# EAGLE schematic YAZ180_V22 (EAGLE 6.6.0)

## Sheet 1 of 7
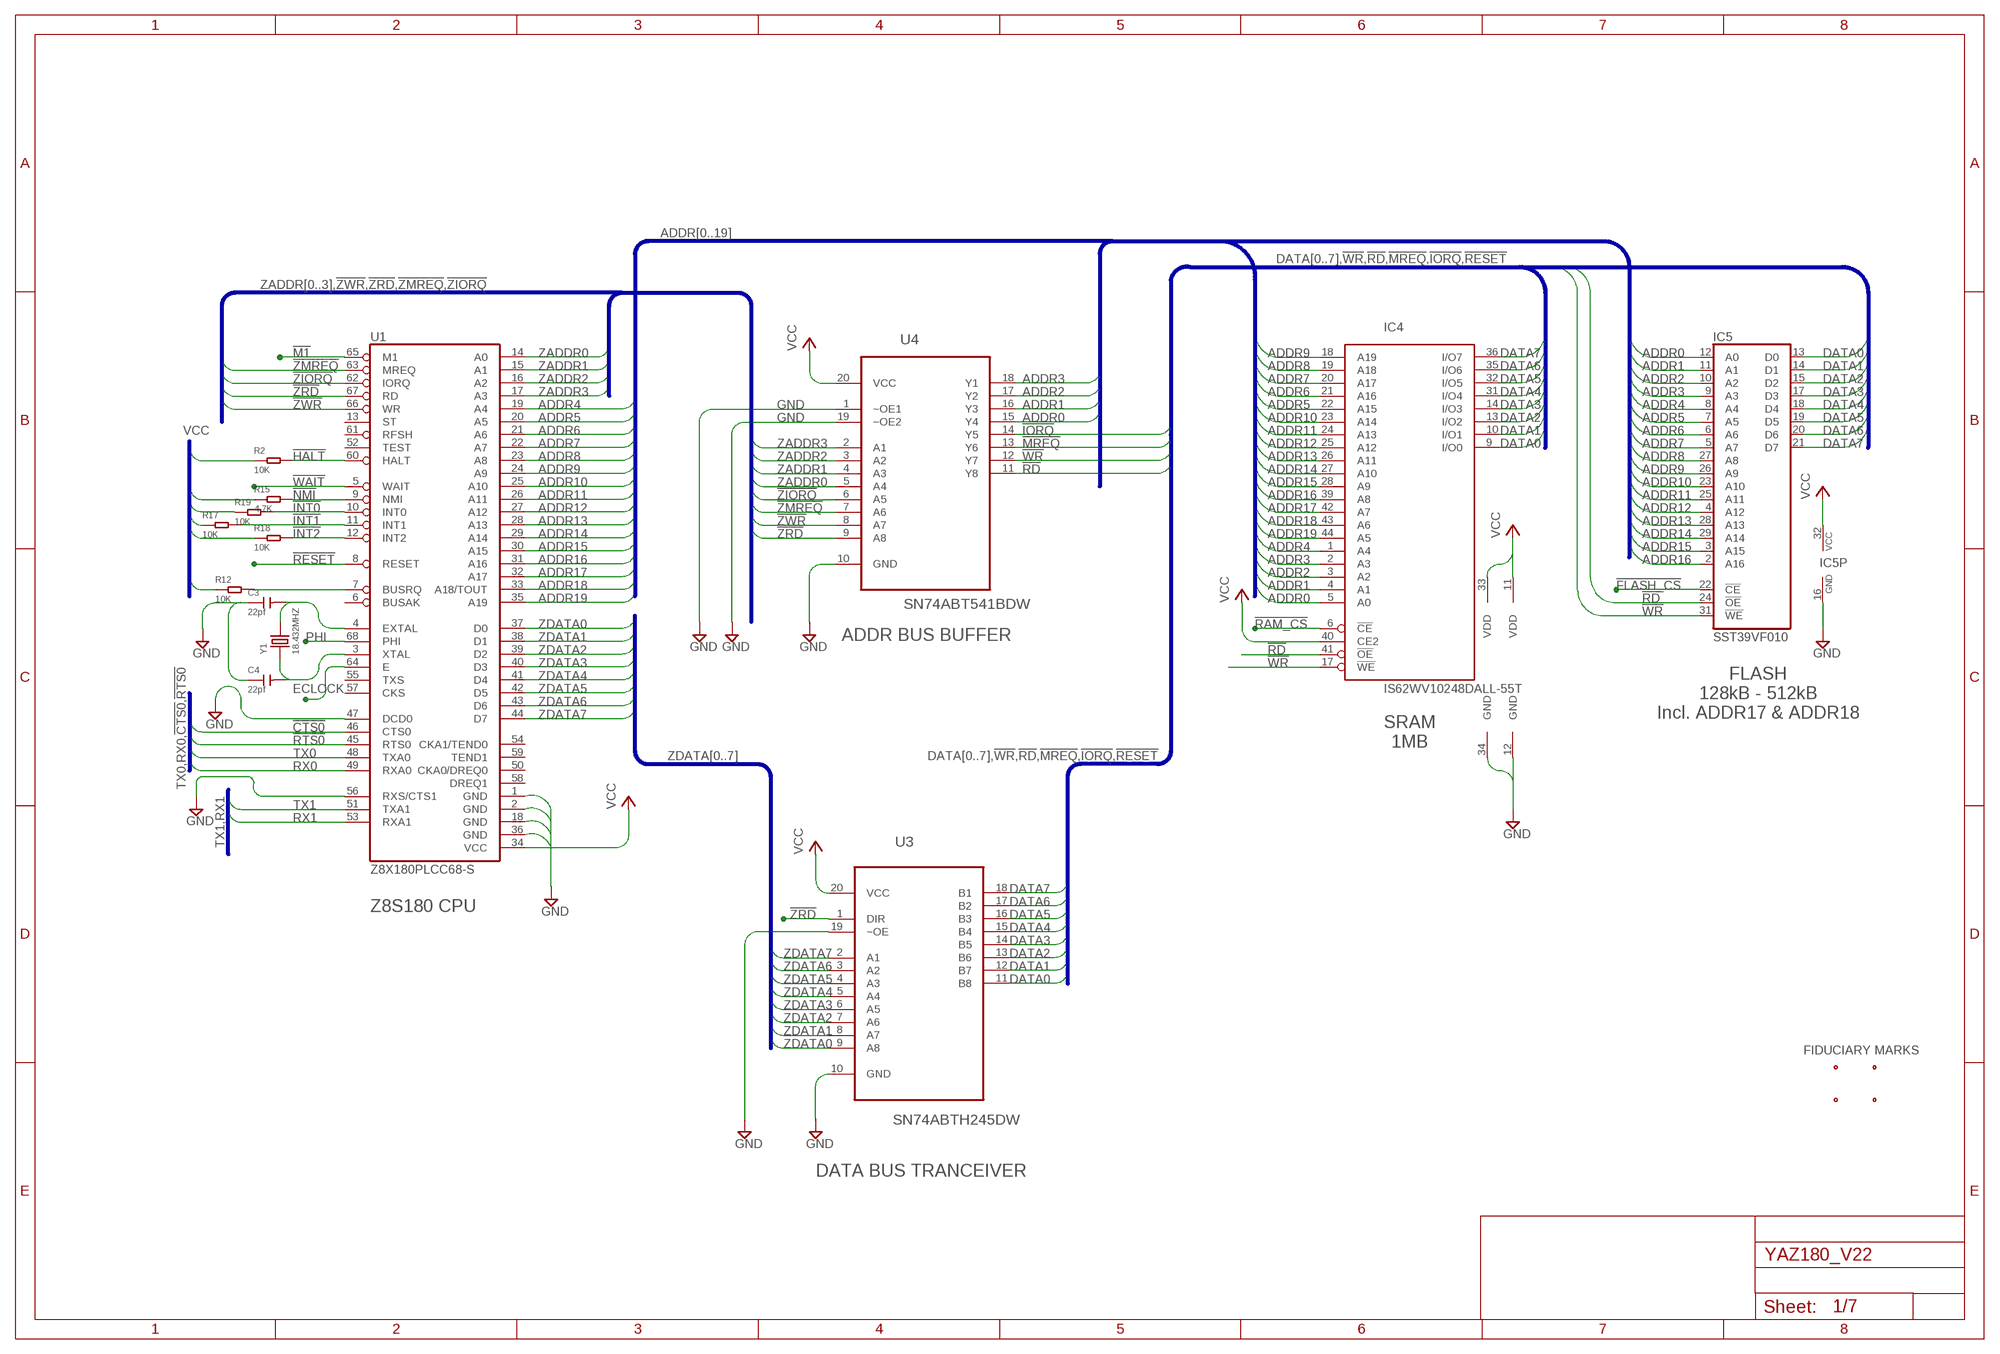
[diagram p0: schematic, sheet 1]

### Parts
C3  22pf  CERAMIC-22PF-50V-5%-NPO(0603)  [C0603]
C4  22pf  CERAMIC-22PF-50V-5%-NPO(0603)  [C0603]
IC4  IS62WV10248DALL-55T  [TSOP-II-44]
IC5  SST39VF010  [S32]
R2  10K  SMD-RES-10K-1%-1/10W(0603)  [R0603]
R12  10K  SMD-RES-10K-1%-1/10W(0603)  [R0603]
R15  4.7K  SMD-RES-4.7K-5%-1/10W(0603)  [R0603]
R17  10K  SMD-RES-10K-1%-1/10W(0603)  [R0603]
R18  10K  SMD-RES-10K-1%-1/10W(0603)  [R0603]
R19  10K  SMD-RES-10K-1%-1/10W(0603)  [R0603]
U1  Z8X180PLCC68-S  [PLCC-S68]
U3  SN74ABTH245DW  [SOIC127P1030X265-20N]
U4  SN74ABT541BDW  [SOIC127P1030X265-20N]
X3  FIDUCIAL_0.6-1.2MM  [FIDUCIAL0.6-1.2]
X4  FIDUCIAL_0.6-1.2MM  [FIDUCIAL0.6-1.2]
X5  FIDUCIAL_0.6-1.2MM  [FIDUCIAL0.6-1.2]
X6  FIDUCIAL_0.6-1.2MM  [FIDUCIAL0.6-1.2]
Y1  18.432MHZ  DIP-CRYSTAL-25MHZ-20PF-20PPM(HC49US)  [HC49US]

### Nets
!BUSRQ: R12.2 U1.7(BUSRQ)
!CTS0: U1.46(CTS0) ; also sheet 4
!FLASH_CS: IC5.22(!CE) ; also sheet 2
!HALT: R2.2 U1.60(HALT) ; also sheet 2
!INT0: R19.2 U1.10(INT0) ; also sheet 5
!INT1: R17.2 U1.11(INT1) ; also sheet 5
!INT2: R18.2 U1.12(INT2) ; also sheet 5
!IORQ: U4.14(Y5) ; also sheet 2
!M1: U1.65(M1) ; also sheet 2
!MREQ: U4.13(Y6) ; also sheet 2
!NMI: R15.2 U1.9(NMI)
!RAM_CS: IC4.6(!CE) ; also sheet 2
!RD: IC4.41(!OE) IC5.24(!OE) U4.11(Y8) ; also sheet 2,3,5,6
!RESET: U1.8(RESET) ; also sheet 2,5
!RTS0: U1.45(RTS0) ; also sheet 4
!WAIT: U1.5(WAIT) ; also sheet 2,3
!WR: IC4.17(!WE) IC5.31(!WE) U4.12(Y7) ; also sheet 2,5,6
!ZIORQ: U1.62(IORQ) U4.6(A5)
!ZMREQ: U1.63(MREQ) U4.7(A6)
!ZRD: U1.67(RD) U3.1(DIR) U4.9(A8)
!ZWR: U1.66(WR) U4.8(A7) ; also sheet 5
ADDR0: IC4.5(A0) IC5.12(A0) U4.15(Y4) ; also sheet 3,5,6
ADDR1: IC4.4(A1) IC5.11(A1) U4.16(Y3) ; also sheet 3,5,6
ADDR2: IC4.3(A2) IC5.10(A2) U4.17(Y2) ; also sheet 3
ADDR3: IC4.2(A3) IC5.9(A3) U4.18(Y1) ; also sheet 3
ADDR4: IC4.1(A4) IC5.8(A4) U1.19(A4) ; also sheet 3
ADDR5: IC4.22(A15) IC5.7(A5) U1.20(A5) ; also sheet 3
ADDR6: IC4.21(A16) IC5.6(A6) U1.21(A6) ; also sheet 3
ADDR7: IC4.20(A17) IC5.5(A7) U1.22(A7) ; also sheet 3
ADDR8: IC4.19(A18) IC5.27(A8) U1.23(A8) ; also sheet 3
ADDR9: IC4.18(A19) IC5.26(A9) U1.24(A9) ; also sheet 3
ADDR10: IC4.23(A14) IC5.23(A10) U1.25(A10) ; also sheet 3
ADDR11: IC4.24(A13) IC5.25(A11) U1.26(A11) ; also sheet 3
ADDR12: IC4.25(A12) IC5.4(A12) U1.27(A12) ; also sheet 3
ADDR13: IC4.26(A11) IC5.28(A13) U1.28(A13) ; also sheet 2,3
ADDR14: IC4.27(A10) IC5.29(A14) U1.29(A14) ; also sheet 2,3
ADDR15: IC4.28(A9) IC5.3(A15) U1.30(A15) ; also sheet 2,3
ADDR16: IC4.39(A8) IC5.2(A16) U1.31(A16) ; also sheet 2,3
ADDR17: IC4.42(A7) U1.32(A17) ; also sheet 2,3,5
ADDR18: IC4.43(A6) U1.33(A18/TOUT) ; also sheet 2,3,5
ADDR19: IC4.44(A5) U1.35(A19) ; also sheet 2,3,5
DATA0: IC4.9(I/O0) IC5.13(D0) U3.11(B8) ; also sheet 3,4,5,6
DATA1: IC4.10(I/O1) IC5.14(D1) U3.12(B7) ; also sheet 3,4,5,6
DATA2: IC4.13(I/O2) IC5.15(D2) U3.13(B6) ; also sheet 3,4,5,6
DATA3: IC4.14(I/O3) IC5.17(D3) U3.14(B5) ; also sheet 3,4,5,6
DATA4: IC4.31(I/O4) IC5.18(D4) U3.15(B4) ; also sheet 3,4,5,6
DATA5: IC4.32(I/O5) IC5.19(D5) U3.16(B3) ; also sheet 3,4,5,6
DATA6: IC4.35(I/O6) IC5.20(D6) U3.17(B2) ; also sheet 3,4,5,6
DATA7: IC4.36(I/O7) IC5.21(D7) U3.18(B1) ; also sheet 3,4,5,6
ECLOCK: U1.64(E) ; also sheet 5
EXTAL: C3.2 U1.4(EXTAL) Y1.2
GND [POWER]: C3.1 C4.1 IC4.12(GND) IC4.34(GND) IC5.16(GND) U1.1(GND) U1.2(GND) U1.18(GND) U1.36(GND) U1.47(DCD0) U1.56(RXS/CTS1) U3.10(GND) U3.19(~OE) U4.1(~OE1) U4.10(GND) U4.19(~OE2) ; also sheet 2,3,4,5,6,7
PHI: U1.68(PHI) ; also sheet 5
RX0: U1.49(RXA0) ; also sheet 4
RX1: U1.53(RXA1) ; also sheet 4
TX0: U1.48(TXA0) ; also sheet 4
TX1: U1.51(TXA1) ; also sheet 4
VCC [POWER]: IC4.11(VDD) IC4.33(VDD) IC4.40(CE2) IC5.32(VCC) R2.1 R12.1 R15.1 R17.1 R18.1 R19.1 U1.34(VCC) U3.20(VCC) U4.20(VCC) ; also sheet 2,3,4,5,6,7
XTAL: C4.2 U1.3(XTAL) Y1.1
ZADDR0: U1.14(A0) U4.5(A4)
ZADDR1: U1.15(A1) U4.4(A3)
ZADDR2: U1.16(A2) U4.3(A2)
ZADDR3: U1.17(A3) U4.2(A1)
ZDATA0: U1.37(D0) U3.9(A8)
ZDATA1: U1.38(D1) U3.8(A7)
ZDATA2: U1.39(D2) U3.7(A6)
ZDATA3: U1.40(D3) U3.6(A5)
ZDATA4: U1.41(D4) U3.5(A4)
ZDATA5: U1.42(D5) U3.4(A3)
ZDATA6: U1.43(D6) U3.3(A2)
ZDATA7: U1.44(D7) U3.2(A1)
Unconnected: U1.6(BUSAK) U1.13(ST) U1.50(CKA0/DREQ0) U1.52(TEST) U1.54(CKA1/TEND0) U1.55(TXS) U1.57(CKS) U1.58(DREQ1) U1.59(TEND1) U1.61(RFSH)

### Buses
ADDR[0..19]
DATA[0..7],!WR,!RD,!MREQ,!IORQ,!RESET
TX0,RX0,!CTS0,!RTS0
TX1,RX1
VCC
ZADDR[0..3],!ZWR,!ZRD,!ZMREQ,!ZIORQ
ZDATA[0..7]

### Notes on the sheet
- ADDR BUS BUFFER
- FLASH
  128kB - 512kB
  Incl. ADDR17 & ADDR18
- SRAM
  1MB
- Z8S180 CPU
- FIDUCIARY MARKS
- DATA BUS TRANCEIVER

## Sheet 2 of 7
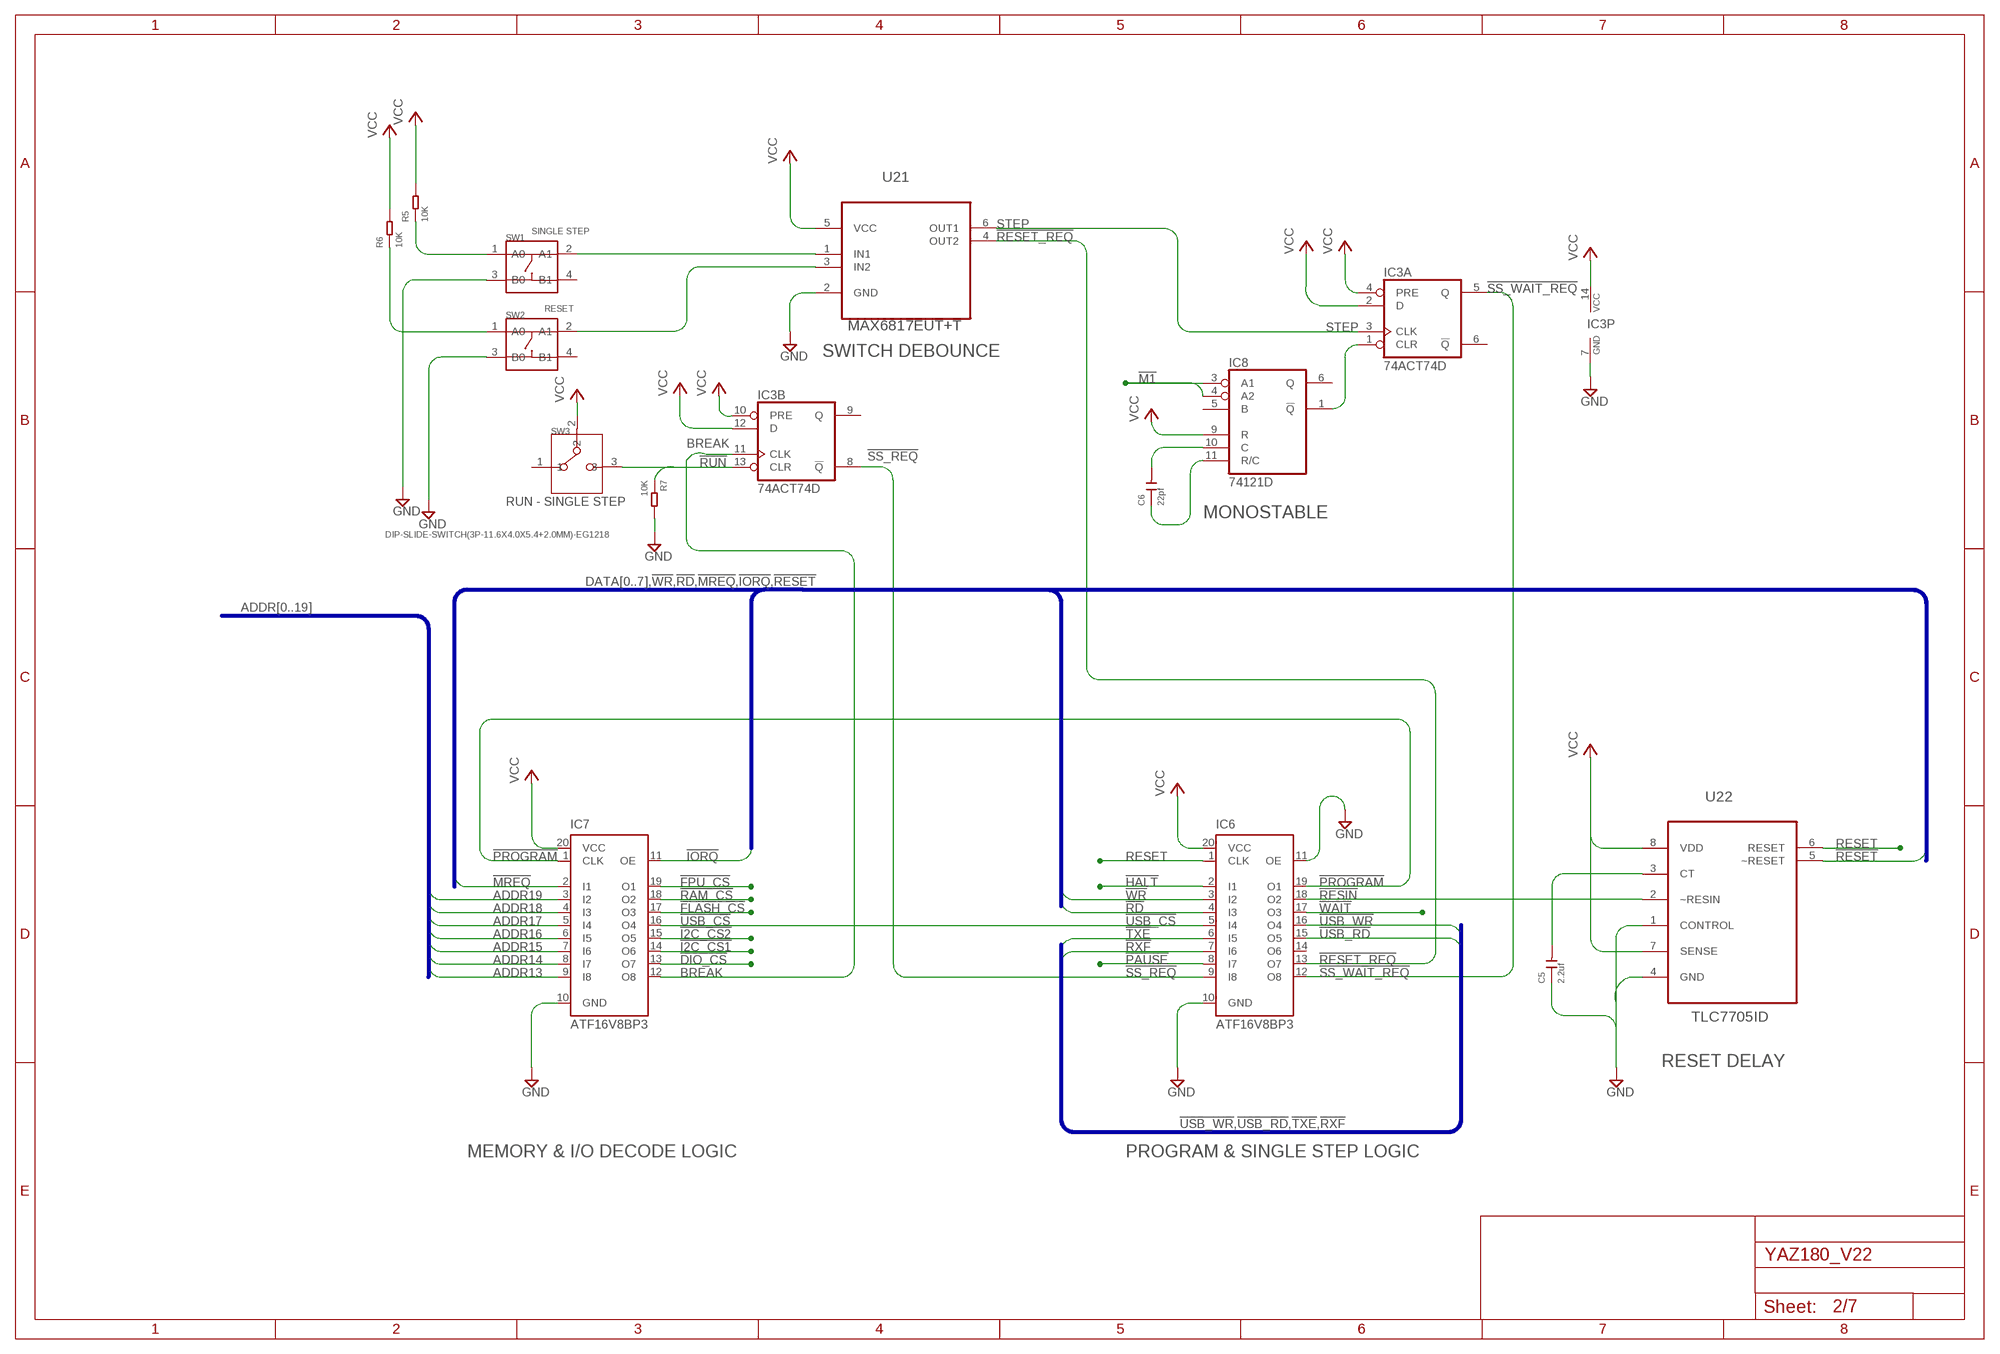
[diagram p1: schematic, sheet 2]

### Parts
C5  2.2uf  CERAMIC-2.2UF-10V-10%-X7R(0603)  [C0603]
C6  22pf  CERAMIC-22PF-50V-5%-NPO(0603)  [C0603]
IC3  74ACT74D  [SO14]
IC6  ATF16V8BP3  [DIL20]
IC7  ATF16V8BP3  [DIL20]
IC8  74121D  [SO14]
R5  10K  SMD-RES-10K-1%-1/10W(0603)  [R0603]
R6  10K  SMD-RES-10K-1%-1/10W(0603)  [R0603]
R7  10K  SMD-RES-10K-1%-1/10W(0603)  [R0603]
SW1  SINGLE STEP  SMD-BUTTON(4P-4.0X4.0X1.7MM)-DHT-1152  [SW4-SMD-4.0X4.0X1.7MM]
SW2  RESET  SMD-BUTTON(4P-4.0X4.0X1.7MM)-DHT-1152  [SW4-SMD-4.0X4.0X1.7MM]
SW3  DIP-SLIDE-SWITCH(3P-11.6X4.0X5.4+2.0MM)-EG1218  [SW3-2.5-11.6X4.0X5.4+2.0MM]
U21  MAX6817EUT+T  [SOT95P280X145-6N]
U22  TLC7705ID  [SOIC127P600X175-8N]

### Nets
!DIO_CS: IC7.13(O7) ; also sheet 6
!FLASH_CS: IC7.17(O3) ; also sheet 1
!FPU_CS: IC7.19(O1) ; also sheet 5
!HALT: IC6.2(I1) ; also sheet 1
!I2C_CS1: IC7.14(O6) ; also sheet 5
!I2C_CS2: IC7.15(O5) ; also sheet 5
!IORQ: IC7.11(OE) ; also sheet 1
!M1: IC8.3(A1) IC8.4(A2) ; also sheet 1
!MREQ: IC7.2(I1) ; also sheet 1
!PAUSE: IC6.8(I7) ; also sheet 5
!PROGRAM: IC6.19(O1) IC7.1(CLK)
!RAM_CS: IC7.18(O2) ; also sheet 1
!RD: IC6.4(I3) ; also sheet 1,3,5,6
!RESET: U22.5(~RESET) ; also sheet 1,5
!RESET_REQ: IC6.13(O7) U21.4(OUT2)
!RESIN: IC6.18(O2) U22.2(~RESIN)
!RUN: IC3.13(B:CLR) R7.1 SW3.3
!RXF: IC6.7(I6) ; also sheet 4
!SS_REQ: IC3.8(B:!Q) IC6.9(I8)
!SS_WAIT_REQ: IC3.5(A:Q) IC6.12(O8)
!TXE: IC6.6(I5) ; also sheet 4
!USB_CS: IC6.5(I4) IC7.16(O4)
!USB_RD: IC6.15(O5) ; also sheet 4
!USB_WR: IC6.16(O4) ; also sheet 4
!WAIT: IC6.17(O3) ; also sheet 1,3
!WR: IC6.3(I2) ; also sheet 1,5,6
ADDR13: IC7.9(I8) ; also sheet 1,3
ADDR14: IC7.8(I7) ; also sheet 1,3
ADDR15: IC7.7(I6) ; also sheet 1,3
ADDR16: IC7.6(I5) ; also sheet 1,3
ADDR17: IC7.5(I4) ; also sheet 1,3,5
ADDR18: IC7.4(I3) ; also sheet 1,3,5
ADDR19: IC7.3(I2) ; also sheet 1,3,5
BREAK: IC3.11(B:CLK) IC7.12(O8)
GND [POWER]: C5.1 IC3.7(P:GND) IC6.10(GND) IC6.11(OE) IC7.10(GND) R7.2 SW1.3(B0) SW2.3(B0) U21.2(GND) U22.1(CONTROL) U22.4(GND) ; also sheet 1,3,4,5,6,7
N$1: IC3.1(A:CLR) IC8.1(!Q)
N$66: C5.2 U22.3(CT)
N$69: C6.2 IC8.10(C)
N$71: SW1.2(A1) U21.1(IN1)
N$74: R5.1 SW1.1(A0)
N$75: R6.1 SW2.1(A0)
N$76: SW2.2(A1) U21.3(IN2)
N$77: C6.1 IC8.11(R/C)
RESET: IC6.1(CLK) U22.6(RESET) ; also sheet 5,6
STEP: IC3.3(A:CLK) U21.6(OUT1)
VCC [POWER]: IC3.2(A:D) IC3.4(A:PRE) IC3.10(B:PRE) IC3.12(B:D) IC3.14(P:VCC) IC6.20(VCC) IC7.20(VCC) IC8.9(R) R5.2 R6.2 SW3.2 U21.5(VCC) U22.7(SENSE) U22.8(VDD) ; also sheet 1,3,4,5,6,7
Unconnected: IC3.6(A:!Q) IC3.9(B:Q) IC6.14(O6) IC8.5(B) IC8.6(Q) SW1.4(B1) SW2.4(B1) SW3.1

### Buses
ADDR[0..19]
DATA[0..7],!WR,!RD,!MREQ,!IORQ,!RESET
!USB_WR,!USB_RD,!TXE,!RXF

### Notes on the sheet
- SWITCH DEBOUNCE
- RUN - SINGLE STEP
- MONOSTABLE
- RESET DELAY
- MEMORY & I/O DECODE LOGIC | PROGRAM & SINGLE STEP LOGIC

## Sheet 3 of 7
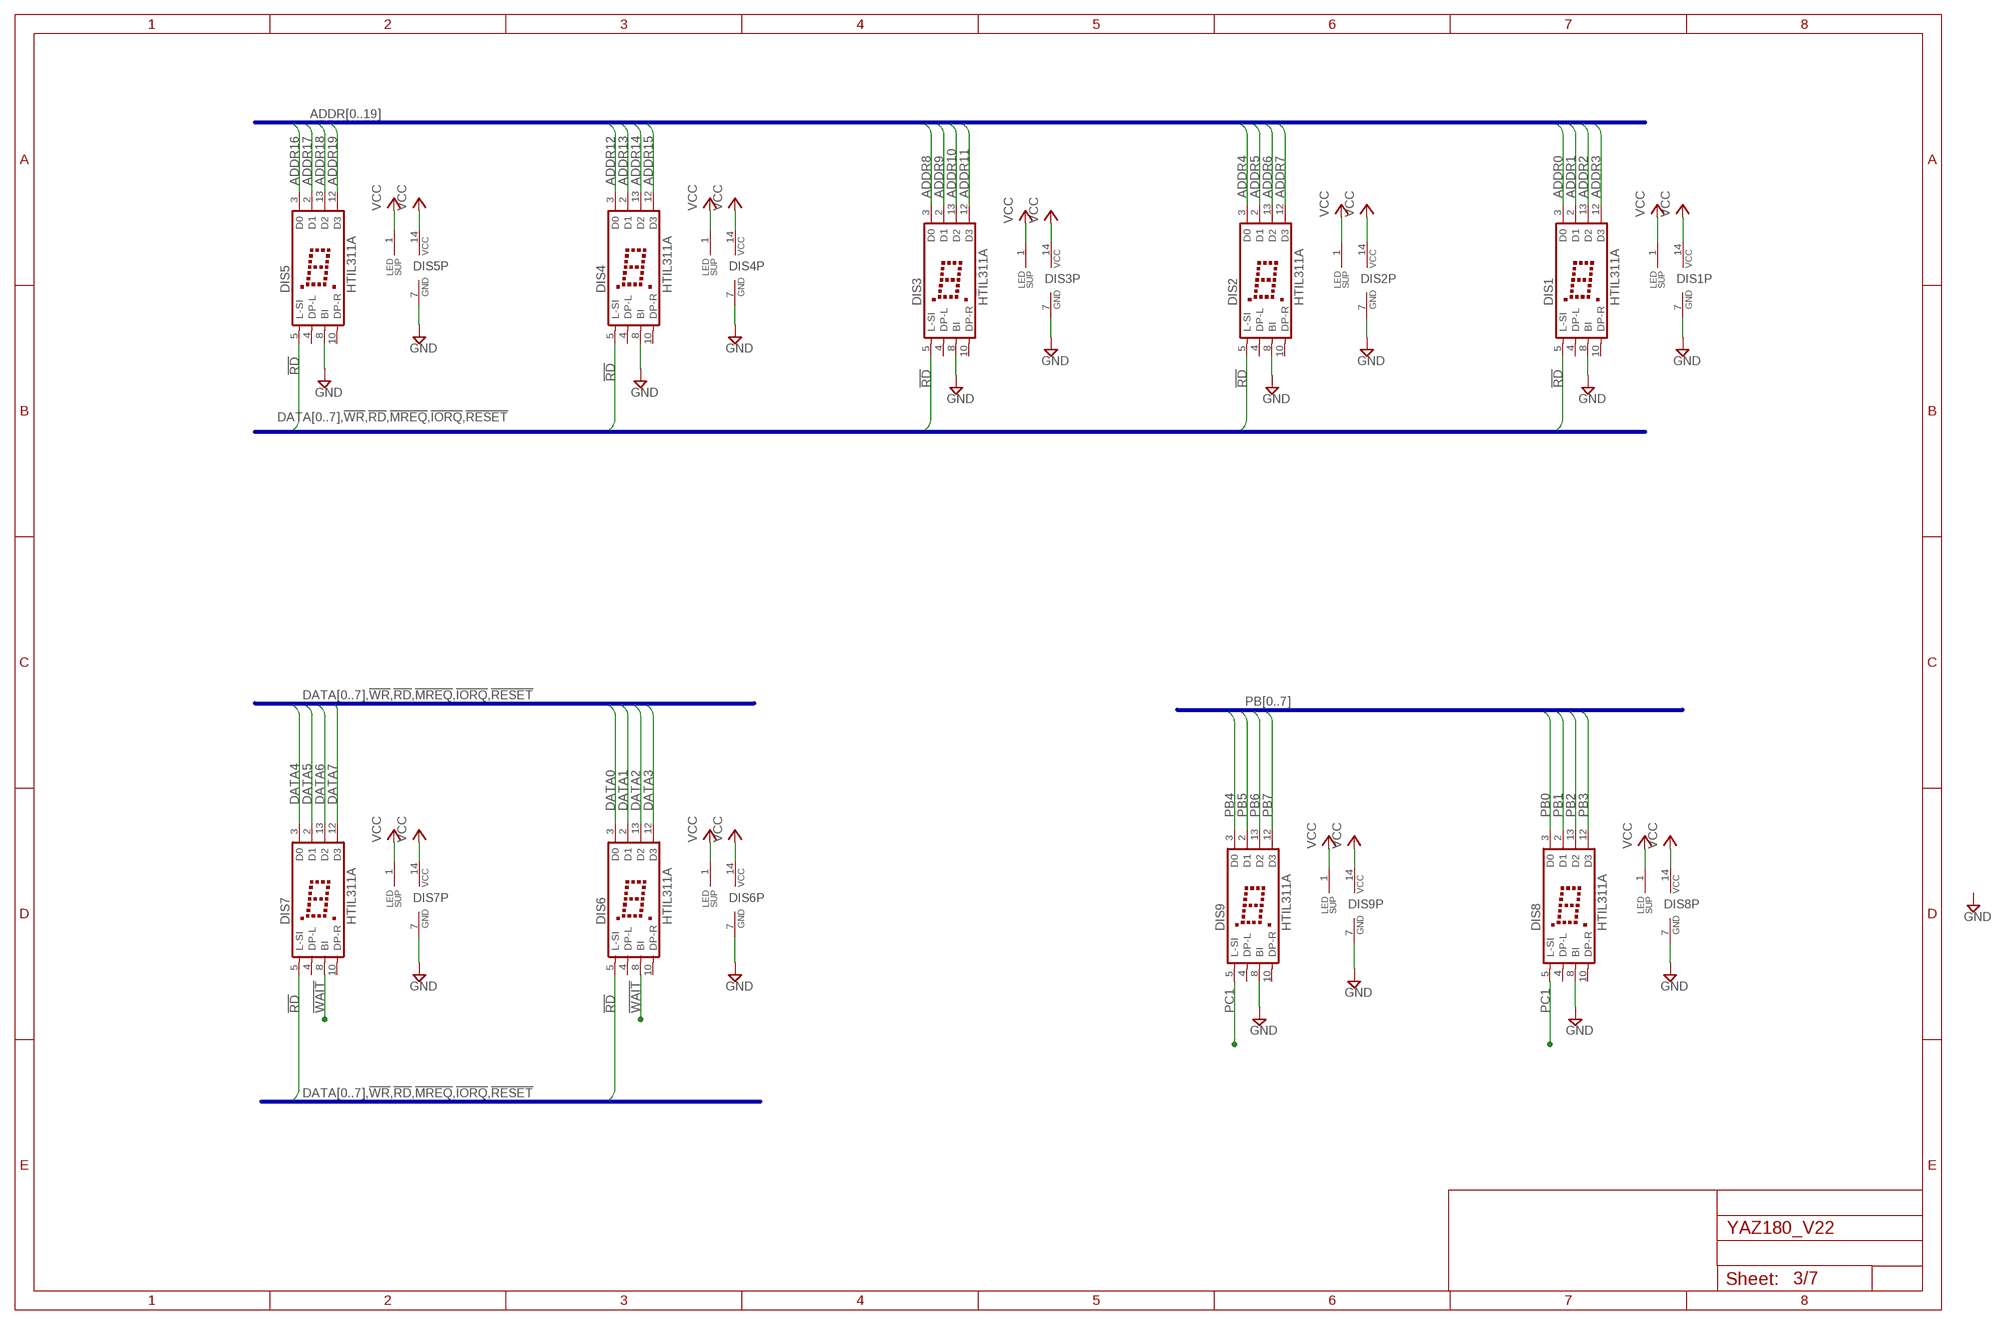
[diagram p2: schematic, sheet 3]

### Parts
DIS1  HTIL311A  [HTIL311A]
DIS2  HTIL311A  [HTIL311A]
DIS3  HTIL311A  [HTIL311A]
DIS4  HTIL311A  [HTIL311A]
DIS5  HTIL311A  [HTIL311A]
DIS6  HTIL311A  [HTIL311A]
DIS7  HTIL311A  [HTIL311A]
DIS8  HTIL311A  [HTIL311A]
DIS9  HTIL311A  [HTIL311A]

### Nets
!RD: DIS1.5(L-SI) DIS2.5(L-SI) DIS3.5(L-SI) DIS4.5(L-SI) DIS5.5(L-SI) DIS6.5(L-SI) DIS7.5(L-SI) ; also sheet 1,2,5,6
!WAIT: DIS6.8(BI) DIS7.8(BI) ; also sheet 1,2
ADDR0: DIS1.3(D0) ; also sheet 1,5,6
ADDR1: DIS1.2(D1) ; also sheet 1,5,6
ADDR2: DIS1.13(D2) ; also sheet 1
ADDR3: DIS1.12(D3) ; also sheet 1
ADDR4: DIS2.3(D0) ; also sheet 1
ADDR5: DIS2.2(D1) ; also sheet 1
ADDR6: DIS2.13(D2) ; also sheet 1
ADDR7: DIS2.12(D3) ; also sheet 1
ADDR8: DIS3.3(D0) ; also sheet 1
ADDR9: DIS3.2(D1) ; also sheet 1
ADDR10: DIS3.13(D2) ; also sheet 1
ADDR11: DIS3.12(D3) ; also sheet 1
ADDR12: DIS4.3(D0) ; also sheet 1
ADDR13: DIS4.2(D1) ; also sheet 1,2
ADDR14: DIS4.13(D2) ; also sheet 1,2
ADDR15: DIS4.12(D3) ; also sheet 1,2
ADDR16: DIS5.3(D0) ; also sheet 1,2
ADDR17: DIS5.2(D1) ; also sheet 1,2,5
ADDR18: DIS5.13(D2) ; also sheet 1,2,5
ADDR19: DIS5.12(D3) ; also sheet 1,2,5
DATA0: DIS6.3(D0) ; also sheet 1,4,5,6
DATA1: DIS6.2(D1) ; also sheet 1,4,5,6
DATA2: DIS6.13(D2) ; also sheet 1,4,5,6
DATA3: DIS6.12(D3) ; also sheet 1,4,5,6
DATA4: DIS7.3(D0) ; also sheet 1,4,5,6
DATA5: DIS7.2(D1) ; also sheet 1,4,5,6
DATA6: DIS7.13(D2) ; also sheet 1,4,5,6
DATA7: DIS7.12(D3) ; also sheet 1,4,5,6
GND [POWER]: DIS1.7(GND) DIS1.8(BI) DIS2.7(GND) DIS2.8(BI) DIS3.7(GND) DIS3.8(BI) DIS4.7(GND) DIS4.8(BI) DIS5.7(GND) DIS5.8(BI) DIS6.7(GND) DIS7.7(GND) DIS8.7(GND) DIS8.8(BI) DIS9.7(GND) DIS9.8(BI) ; also sheet 1,2,4,5,6,7
PB0: DIS8.3(D0) ; also sheet 6
PB1: DIS8.2(D1) ; also sheet 6
PB2: DIS8.13(D2) ; also sheet 6
PB3: DIS8.12(D3) ; also sheet 6
PB4: DIS9.3(D0) ; also sheet 6
PB5: DIS9.2(D1) ; also sheet 6
PB6: DIS9.13(D2) ; also sheet 6
PB7: DIS9.12(D3) ; also sheet 6
PC1: DIS8.5(L-SI) DIS9.5(L-SI) ; also sheet 6
VCC [POWER]: DIS1.1(LEDSUP) DIS1.14(VCC) DIS2.1(LEDSUP) DIS2.14(VCC) DIS3.1(LEDSUP) DIS3.14(VCC) DIS4.1(LEDSUP) DIS4.14(VCC) DIS5.1(LEDSUP) DIS5.14(VCC) DIS6.1(LEDSUP) DIS6.14(VCC) DIS7.1(LEDSUP) DIS7.14(VCC) DIS8.1(LEDSUP) DIS8.14(VCC) DIS9.1(LEDSUP) DIS9.14(VCC) ; also sheet 1,2,4,5,6,7
Unconnected: DIS1.4(DP-L) DIS1.10(DP-R) DIS2.4(DP-L) DIS2.10(DP-R) DIS3.4(DP-L) DIS3.10(DP-R) DIS4.4(DP-L) DIS4.10(DP-R) DIS5.4(DP-L) DIS5.10(DP-R) DIS6.4(DP-L) DIS6.10(DP-R) DIS7.4(DP-L) DIS7.10(DP-R) DIS8.4(DP-L) DIS8.10(DP-R) DIS9.4(DP-L) DIS9.10(DP-R)

### Buses
ADDR[0..19]
DATA[0..7],!WR,!RD,!MREQ,!IORQ,!RESET
PB[0..7]

## Sheet 4 of 7
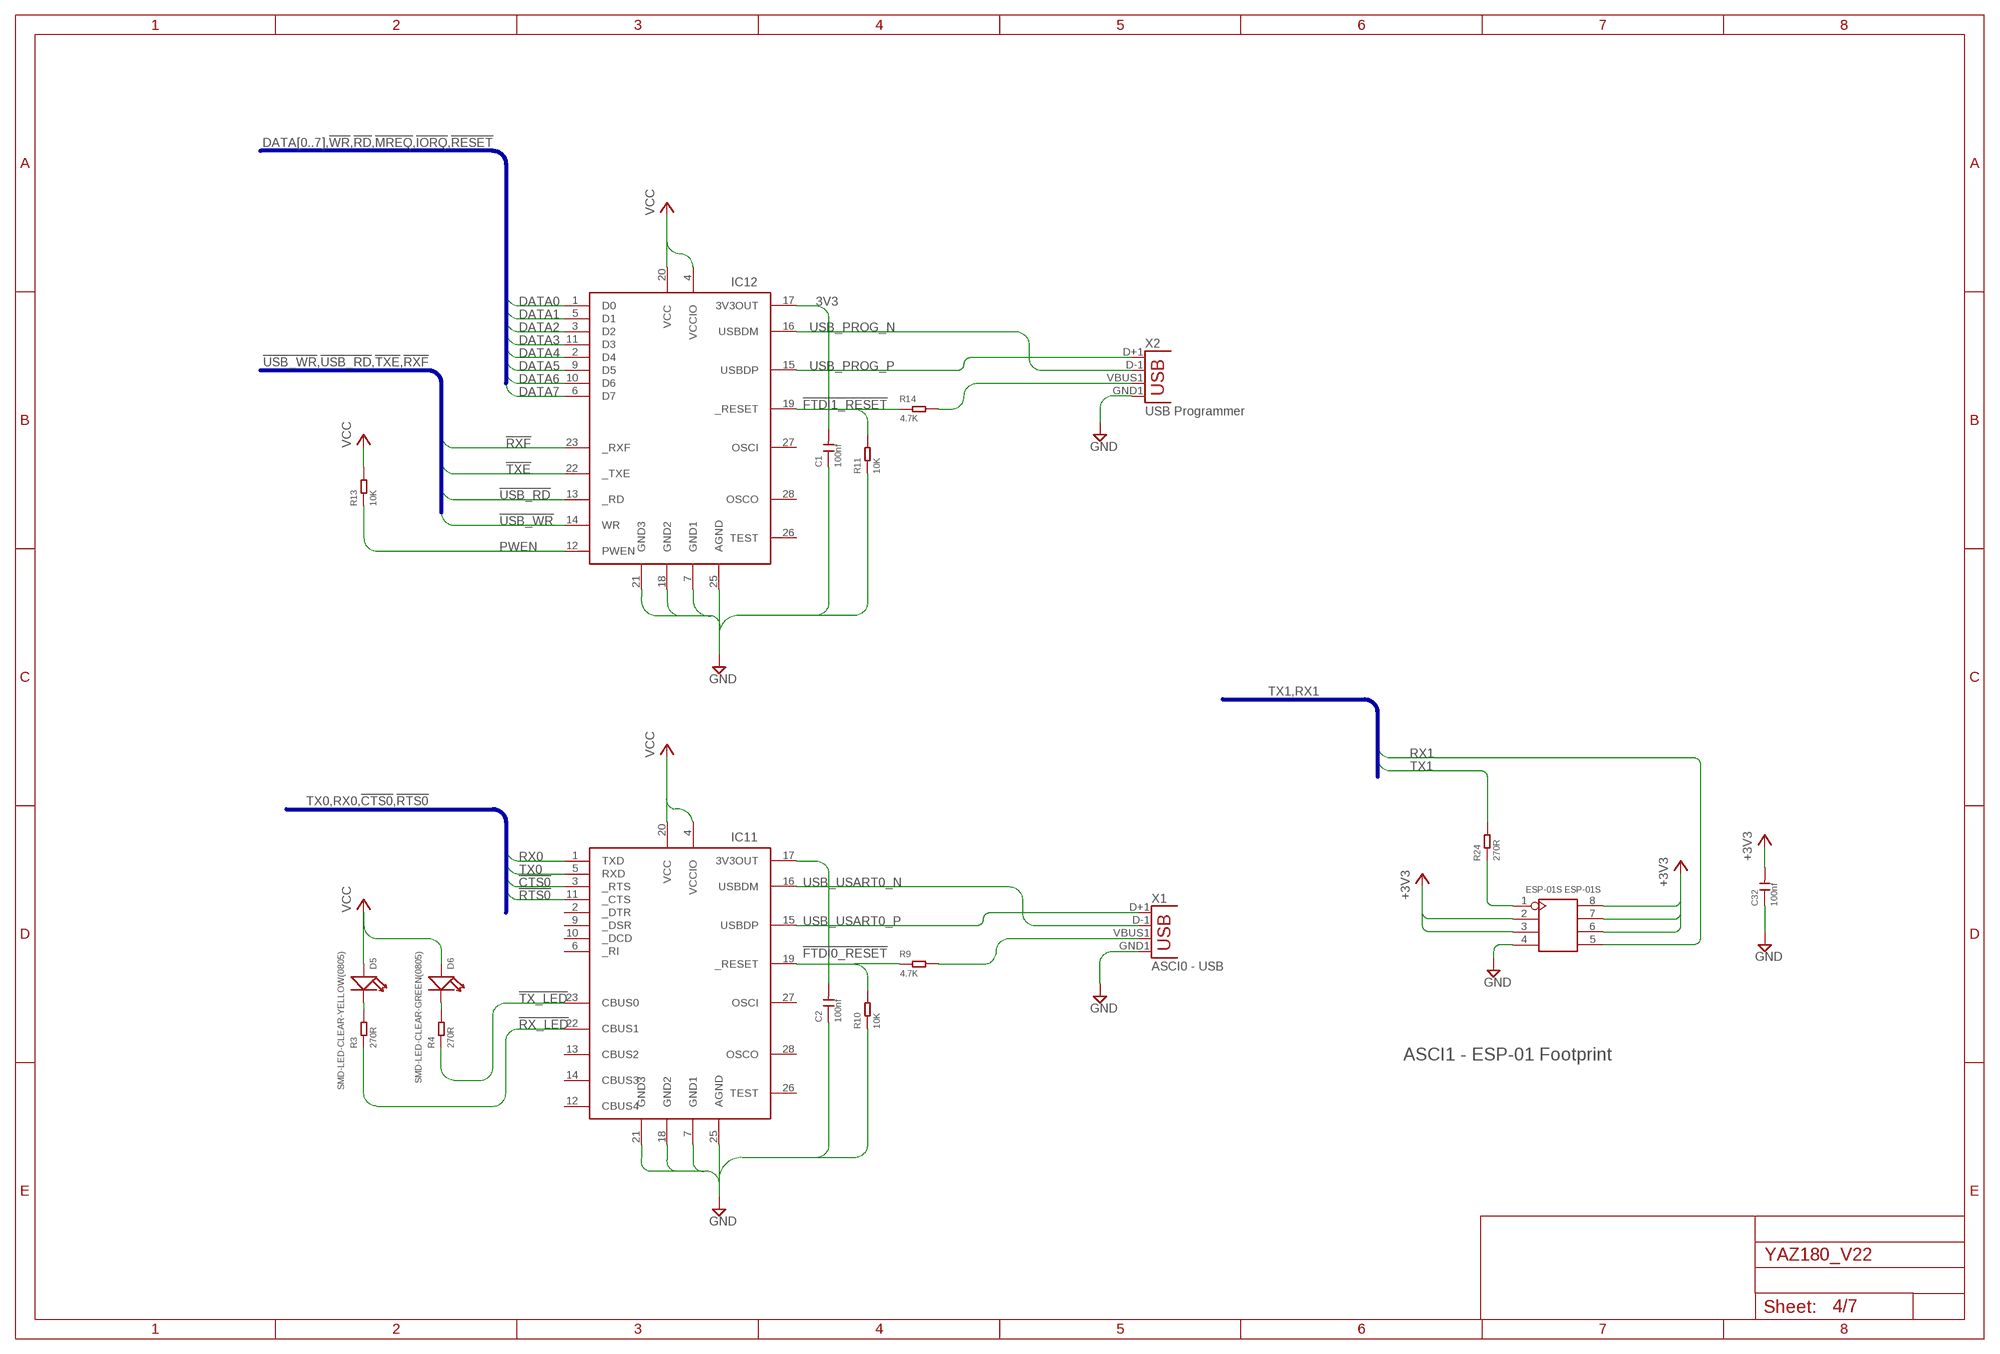
[diagram p3: schematic, sheet 4]

### Parts
C1  100nf  CERAMIC-100NF-50V-10%-X7R(0603)  [C0603]
C2  100nf  CERAMIC-100NF-50V-10%-X7R(0603)  [C0603]
C32  100nf  CERAMIC-100NF-50V-10%-X7R(0603)  [C0603]
D5  SMD-LED-CLEAR-YELLOW(0805)  [LED-0805]
D6  SMD-LED-CLEAR-GREEN(0805)  [LED-0805]
ESP-01S  ESP-01S  DIP-BLACK-FEMALE-HEADER(2X4P-2.54)  [H2X4-2.54]
IC11  FT232RL  [SSOP28DB]
IC12  FT245RL  [SSOP28DB]
R3  270R  SMD-RES-270R-1%-1/10W(0603)  [R0603]
R4  270R  SMD-RES-270R-1%-1/10W(0603)  [R0603]
R9  4.7K  SMD-RES-4.7K-5%-1/10W(0603)  [R0603]
R10  10K  SMD-RES-10K-1%-1/10W(0603)  [R0603]
R11  10K  SMD-RES-10K-1%-1/10W(0603)  [R0603]
R13  10K  SMD-RES-10K-1%-1/10W(0603)  [R0603]
R14  4.7K  SMD-RES-4.7K-5%-1/10W(0603)  [R0603]
R24  270R  SMD-RES-270R-1%-1/10W(0603)  [R0603]
X1  ASCI0 - USB  USBA-SMD-MALE  [USB-A-SMT-MALE]
X2  USB Programmer  USBA-SMD-MALE  [USB-A-SMT-MALE]

### Nets
3V3: C1.2 IC12.17(3V3OUT)
!CTS0: IC11.3(_RTS) ; also sheet 1
!FTDI0_RESET: IC11.19(_RESET) R9.1 R10.2
!FTDI1_RESET: IC12.19(_RESET) R11.2 R14.1
!RTS0: IC11.11(_CTS) ; also sheet 1
!RX_LED: IC11.22(CBUS1) R3.1
!RXF: IC12.23(_RXF) ; also sheet 2
!TX_LED: IC11.23(CBUS0) R4.1
!TXE: IC12.22(_TXE) ; also sheet 2
!USB_RD: IC12.13(_RD) ; also sheet 2
!USB_WR: IC12.14(WR) ; also sheet 2
+3V3 [POWER]: C32.2 ESP-01S.2 ESP-01S.3 ESP-01S.6 ESP-01S.7 ESP-01S.8 ; also sheet 5,7
DATA0: IC12.1(D0) ; also sheet 1,3,5,6
DATA1: IC12.5(D1) ; also sheet 1,3,5,6
DATA2: IC12.3(D2) ; also sheet 1,3,5,6
DATA3: IC12.11(D3) ; also sheet 1,3,5,6
DATA4: IC12.2(D4) ; also sheet 1,3,5,6
DATA5: IC12.9(D5) ; also sheet 1,3,5,6
DATA6: IC12.10(D6) ; also sheet 1,3,5,6
DATA7: IC12.6(D7) ; also sheet 1,3,5,6
GND [POWER]: C1.1 C2.1 C32.1 ESP-01S.4 IC11.7(GND1) IC11.18(GND2) IC11.21(GND3) IC11.25(AGND) IC12.7(GND1) IC12.18(GND2) IC12.21(GND3) IC12.25(AGND) R10.1 R11.1 X1.GND1(GND) X2.GND1(GND) ; also sheet 1,2,3,5,6,7
N$2: R14.2 X2.VBUS1(VBUS)
N$3: R9.2 X1.VBUS1(VBUS)
N$7: ESP-01S.1 R24.1
N$70: C2.2 IC11.17(3V3OUT)
N$72: D5.- R3.2
N$73: D6.- R4.2
PWEN: IC12.12(PWEN) R13.1
RX0: IC11.1(TXD) ; also sheet 1
RX1: ESP-01S.5 ; also sheet 1
TX0: IC11.5(RXD) ; also sheet 1
TX1: R24.2 ; also sheet 1
USB_PROG_N [USB_PROG]: IC12.16(USBDM) X2.D-1(D-)
USB_PROG_P [USB_PROG]: IC12.15(USBDP) X2.D+1(D+)
USB_USART0_N [USB_USART0]: IC11.16(USBDM) X1.D-1(D-)
USB_USART0_P [USB_USART0]: IC11.15(USBDP) X1.D+1(D+)
VCC [POWER]: D5.+ D6.+ IC11.4(VCCIO) IC11.20(VCC) IC12.4(VCCIO) IC12.20(VCC) R13.2 ; also sheet 1,2,3,5,6,7
Unconnected: IC11.2(_DTR) IC11.6(_RI) IC11.9(_DSR) IC11.10(_DCD) IC11.12(CBUS4) IC11.13(CBUS2) IC11.14(CBUS3) IC11.26(TEST) IC11.27(OSCI) IC11.28(OSCO) IC12.26(TEST) IC12.27(OSCI) IC12.28(OSCO)

### Buses
DATA[0..7],!WR,!RD,!MREQ,!IORQ,!RESET
TX0,RX0,!CTS0,!RTS0
TX1,RX1
!USB_WR,!USB_RD,!TXE,!RXF

### Notes on the sheet
- ASCI1 - ESP-01 Footprint

## Sheet 5 of 7
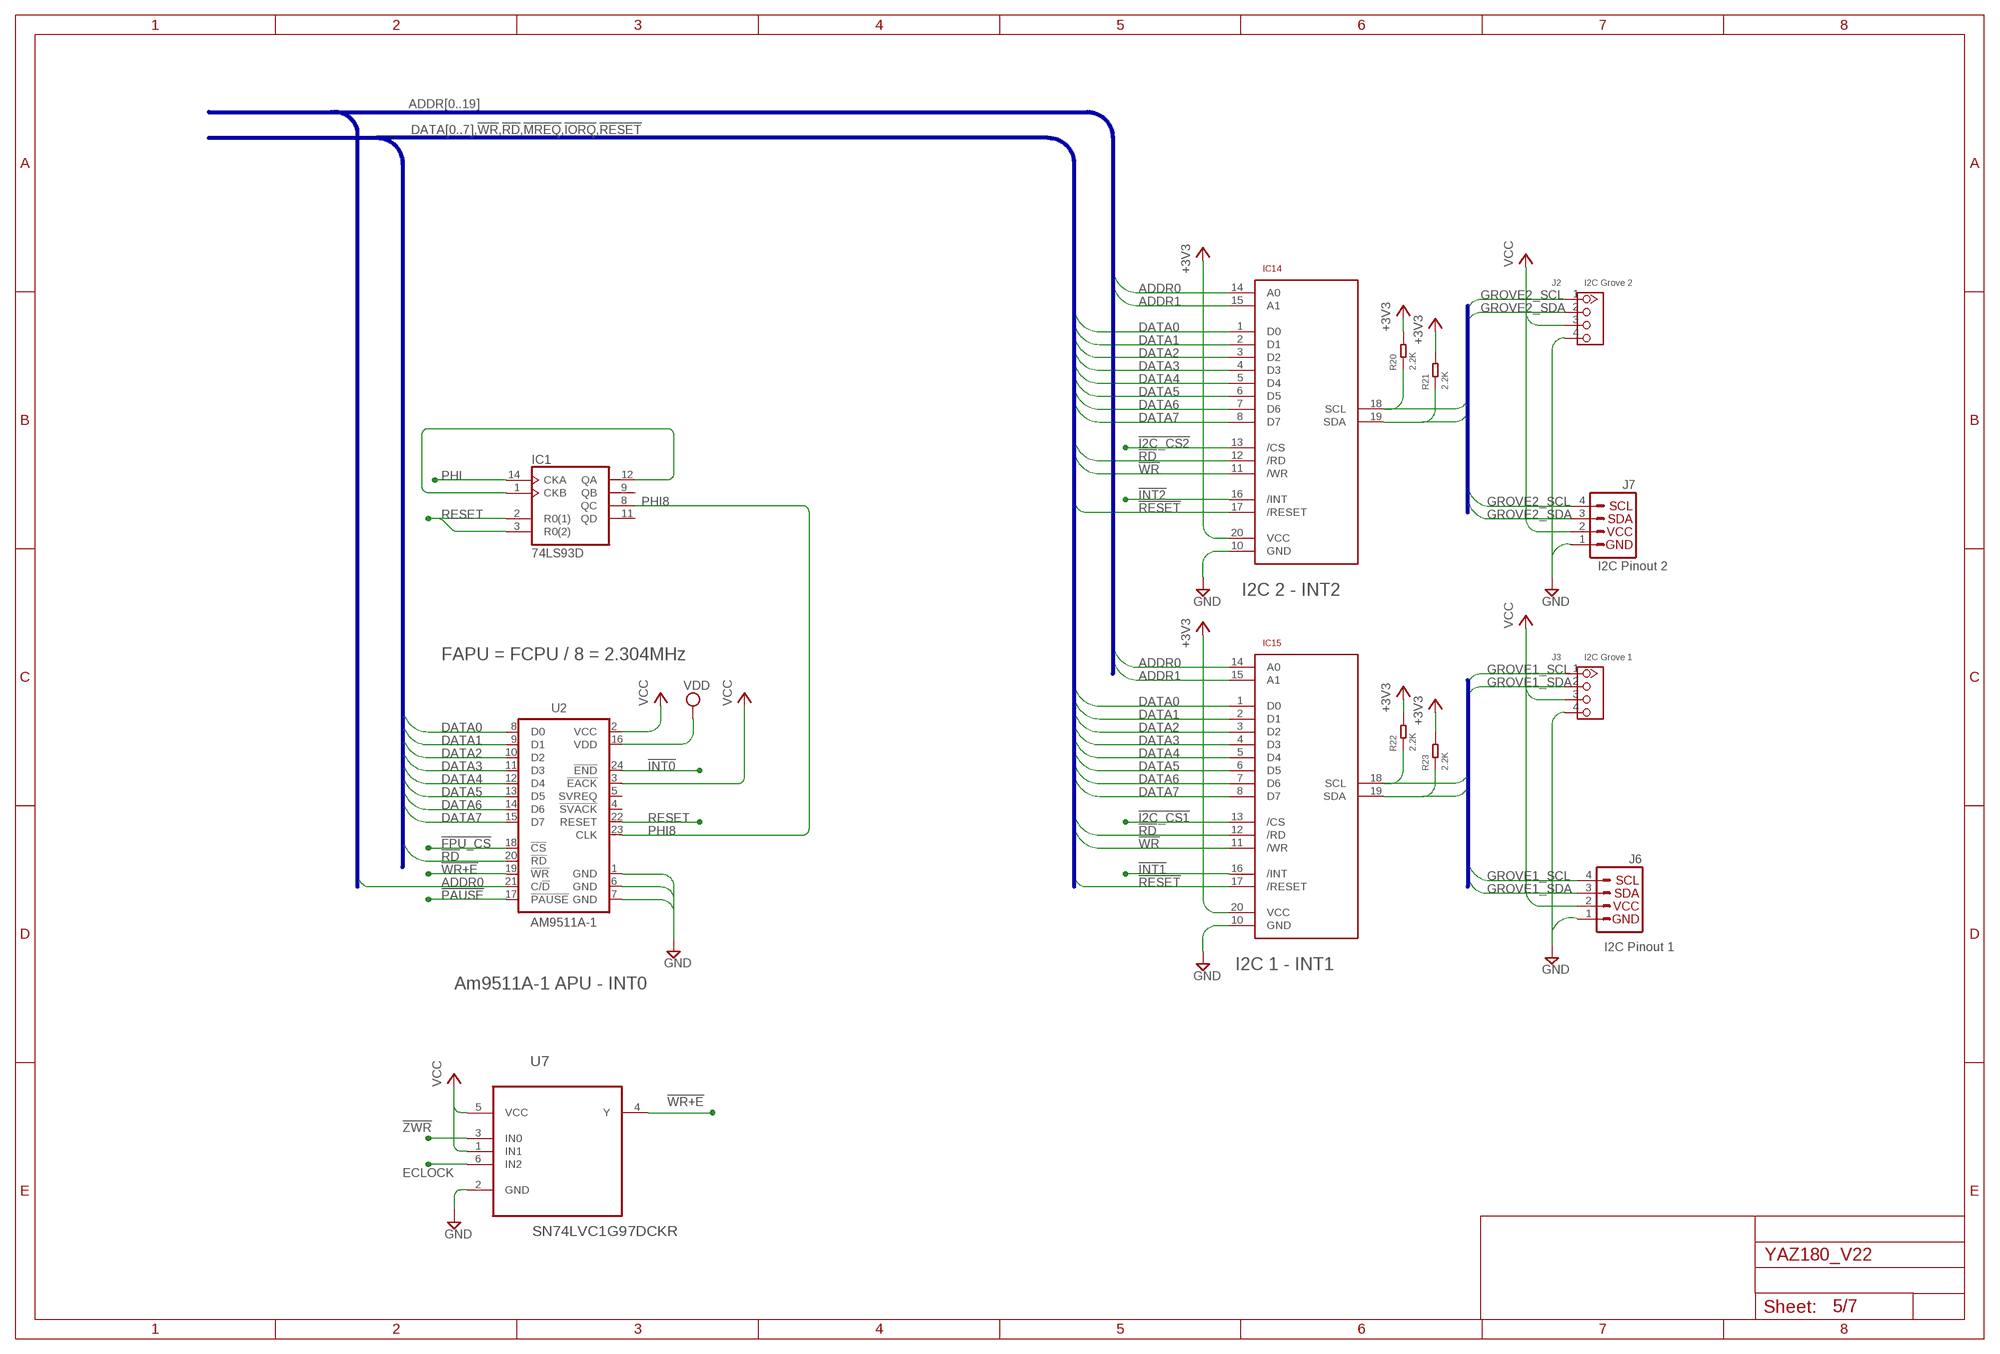
[diagram p4: schematic, sheet 5]

### Parts
IC1  74LS93D  [SO14]
IC14  PCA9665  [TSSOP20]
IC15  PCA9665  [TSSOP20]
J2  I2C Grove 2  GROVE-CONNECTOR-DIP-90D(4P-2.0)  [HW4-2.0-90D]
J3  I2C Grove 1  GROVE-CONNECTOR-DIP-90D(4P-2.0)  [HW4-2.0-90D]
J6  I2C Pinout 1  I2C_STANDARD  [1X04]
J7  I2C Pinout 2  I2C_STANDARD  [1X04]
R20  2.2K  SMD-RES-2.2K-5%-1/10W(0603)  [R0603]
R21  2.2K  SMD-RES-2.2K-5%-1/10W(0603)  [R0603]
R22  2.2K  SMD-RES-2.2K-5%-1/10W(0603)  [R0603]
R23  2.2K  SMD-RES-2.2K-5%-1/10W(0603)  [R0603]
U2  AM9511A-1  AM9511  [DIL24-6]
U7  SN74LVC1G97DCKR  [SOT65P210X110-6N]

### Nets
!FPU_CS: U2.18(!CS) ; also sheet 2
!I2C_CS1: IC15.13(/CS) ; also sheet 2
!I2C_CS2: IC14.13(/CS) ; also sheet 2
!INT0: U2.24(!END) ; also sheet 1
!INT1: IC15.16(/INT) ; also sheet 1
!INT2: IC14.16(/INT) ; also sheet 1
!PAUSE: U2.17(!PAUSE) ; also sheet 2
!RD: IC14.12(/RD) IC15.12(/RD) U2.20(!RD) ; also sheet 1,2,3,6
!RESET: IC14.17(/RESET) IC15.17(/RESET) ; also sheet 1,2
!WR: IC14.11(/WR) IC15.11(/WR) ; also sheet 1,2,6
!WR+E: U2.19(!WR) U7.4(Y)
!ZWR: U7.3(IN0) ; also sheet 1
+3V3 [POWER]: IC14.20(VCC) IC15.20(VCC) R20.2 R21.2 R22.2 R23.2 ; also sheet 4,7
ADDR0: IC14.14(A0) IC15.14(A0) U2.21(C/!D) ; also sheet 1,3,6
ADDR1: IC14.15(A1) IC15.15(A1) ; also sheet 1,3,6
DATA0: IC14.1(D0) IC15.1(D0) U2.8(D0) ; also sheet 1,3,4,6
DATA1: IC14.2(D1) IC15.2(D1) U2.9(D1) ; also sheet 1,3,4,6
DATA2: IC14.3(D2) IC15.3(D2) U2.10(D2) ; also sheet 1,3,4,6
DATA3: IC14.4(D3) IC15.4(D3) U2.11(D3) ; also sheet 1,3,4,6
DATA4: IC14.5(D4) IC15.5(D4) U2.12(D4) ; also sheet 1,3,4,6
DATA5: IC14.6(D5) IC15.6(D5) U2.13(D5) ; also sheet 1,3,4,6
DATA6: IC14.7(D6) IC15.7(D6) U2.14(D6) ; also sheet 1,3,4,6
DATA7: IC14.8(D7) IC15.8(D7) U2.15(D7) ; also sheet 1,3,4,6
ECLOCK: U7.6(IN2) ; also sheet 1
GND [POWER]: IC14.10(GND) IC15.10(GND) J2.4 J3.4 J6.1 J7.1 U2.1(GND) U2.6(GND) U2.7(GND) U7.2(GND) ; also sheet 1,2,3,4,6,7
GROVE1_SCL: IC15.18(SCL) J3.1 J6.4 R22.1
GROVE1_SDA: IC15.19(SDA) J3.2 J6.3 R23.1
GROVE2_SCL: IC14.18(SCL) J2.1 J7.4 R20.1
GROVE2_SDA: IC14.19(SDA) J2.2 J7.3 R21.1
N$4: IC1.1(CKB) IC1.12(QA)
PHI: IC1.14(CKA) ; also sheet 1
PHI8: IC1.8(QC) U2.23(CLK)
RESET: IC1.2(R0(1)) IC1.3(R0(2)) U2.22(RESET) ; also sheet 2,6
VCC [POWER]: J2.3 J3.3 J6.2 J7.2 U2.2(VCC) U2.3(!EACK) U7.1(IN1) U7.5(VCC) ; also sheet 1,2,3,4,6,7
VDD [POWER]: U2.16(VDD) ; also sheet 7
Unconnected: IC1.9(QB) IC1.11(QD) U2.4(!SVACK) U2.5(SVREQ)

### Buses
ADDR[0..19]
DATA[0..7],!WR,!RD,!MREQ,!IORQ,!RESET
GROVE1_SCL,GROVE1_SDA
GROVE2_SCL,GROVE2_SDA

### Notes on the sheet
- I2C 2 - INT2
- FAPU = FCPU / 8 = 2.304MHz
- I2C 1 - INT1
- Am9511A-1 APU - INT0

## Sheet 6 of 7
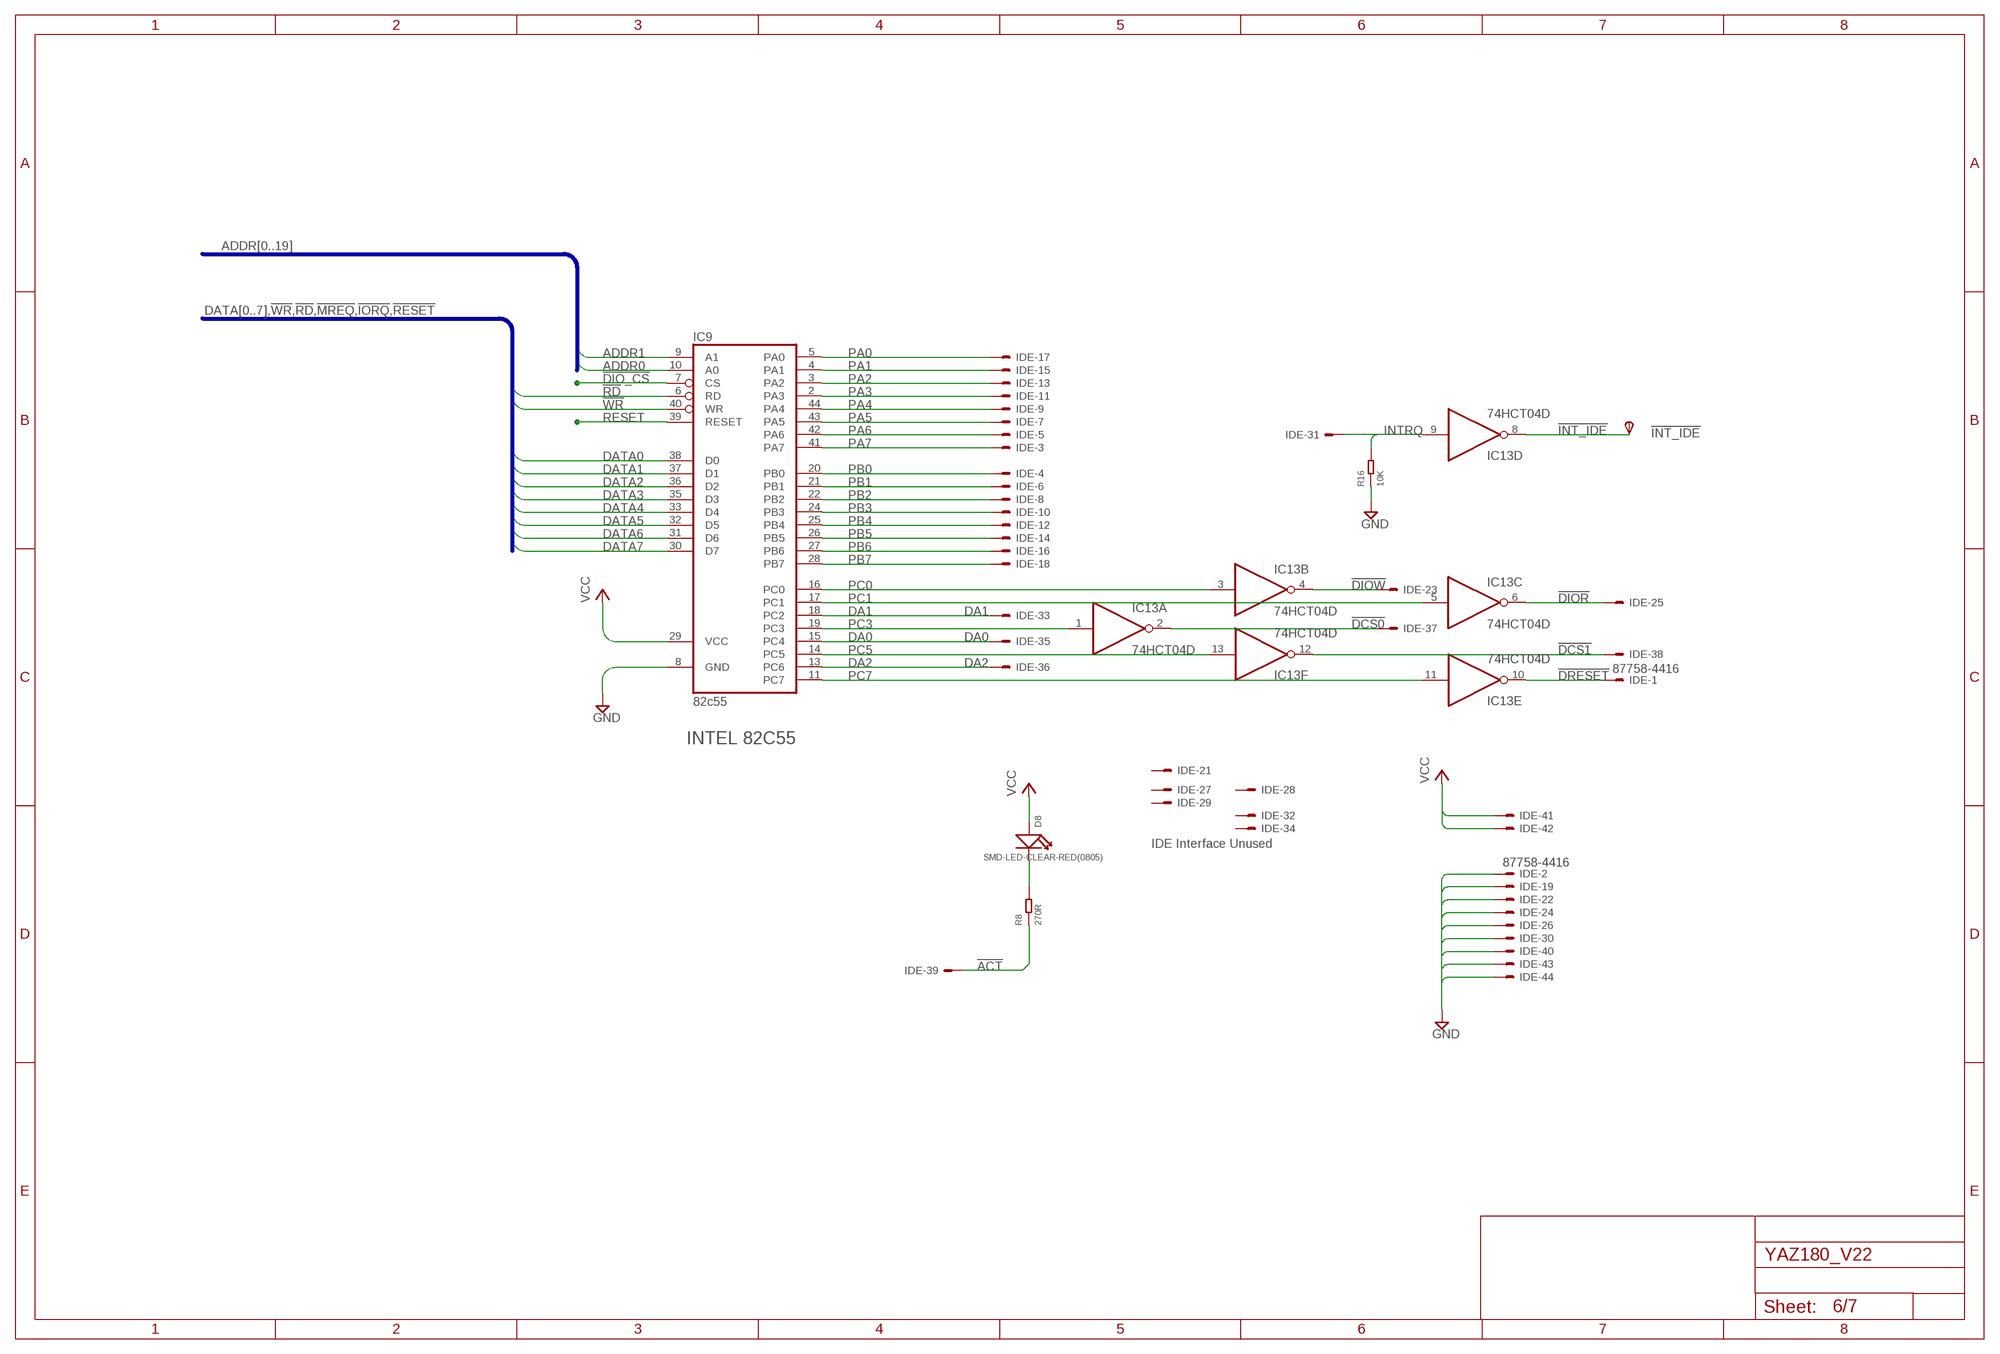
[diagram p5: schematic, sheet 6]

### Parts
!INT_IDE  TPSPAD1-13  [P1-13]
D8  SMD-LED-CLEAR-RED(0805)  [LED-0805]
IC9  82c55  82C55APLCC44-S  [S44]
IC13  74HCT04D  [SO14]
IDE  87758-4416  [87758-4416]
R8  270R  SMD-RES-270R-1%-1/10W(0603)  [R0603]
R16  10K  SMD-RES-10K-1%-1/10W(0603)  [R0603]

### Nets
!ACT: IDE.39 R8.1
!DCS0: IC13.2(A:O) IDE.37
!DCS1: IC13.12(F:O) IDE.38
!DIO_CS: IC9.7(CS) ; also sheet 2
!DIOR: IC13.6(C:O) IDE.25
!DIOW: IC13.4(B:O) IDE.23
!DRESET: IC13.10(E:O) IDE.1
!INT_IDE: !INT_IDE.TP(PP) IC13.8(D:O)
!RD: IC9.6(RD) ; also sheet 1,2,3,5
!WR: IC9.40(WR) ; also sheet 1,2,5
ADDR0: IC9.10(A0) ; also sheet 1,3,5
ADDR1: IC9.9(A1) ; also sheet 1,3,5
DA0: IC9.15(PC4) IDE.35
DA1: IC9.18(PC2) IDE.33
DA2: IC9.13(PC6) IDE.36
DATA0: IC9.38(D0) ; also sheet 1,3,4,5
DATA1: IC9.37(D1) ; also sheet 1,3,4,5
DATA2: IC9.36(D2) ; also sheet 1,3,4,5
DATA3: IC9.35(D3) ; also sheet 1,3,4,5
DATA4: IC9.33(D4) ; also sheet 1,3,4,5
DATA5: IC9.32(D5) ; also sheet 1,3,4,5
DATA6: IC9.31(D6) ; also sheet 1,3,4,5
DATA7: IC9.30(D7) ; also sheet 1,3,4,5
GND [POWER]: IC9.8(GND) IDE.2 IDE.19 IDE.22 IDE.24 IDE.26 IDE.30 IDE.40 IDE.43 IDE.44 R16.1 ; also sheet 1,2,3,4,5,7
INTRQ: IC13.9(D:I) IDE.31 R16.2
N$6: D8.- R8.2
PA0: IC9.5(PA0) IDE.17
PA1: IC9.4(PA1) IDE.15
PA2: IC9.3(PA2) IDE.13
PA3: IC9.2(PA3) IDE.11
PA4: IC9.44(PA4) IDE.9
PA5: IC9.43(PA5) IDE.7
PA6: IC9.42(PA6) IDE.5
PA7: IC9.41(PA7) IDE.3
PB0: IC9.20(PB0) IDE.4 ; also sheet 3
PB1: IC9.21(PB1) IDE.6 ; also sheet 3
PB2: IC9.22(PB2) IDE.8 ; also sheet 3
PB3: IC9.24(PB3) IDE.10 ; also sheet 3
PB4: IC9.25(PB4) IDE.12 ; also sheet 3
PB5: IC9.26(PB5) IDE.14 ; also sheet 3
PB6: IC9.27(PB6) IDE.16 ; also sheet 3
PB7: IC9.28(PB7) IDE.18 ; also sheet 3
PC0: IC9.16(PC0) IC13.3(B:I)
PC1: IC9.17(PC1) IC13.5(C:I) ; also sheet 3
PC3: IC9.19(PC3) IC13.1(A:I)
PC5: IC9.14(PC5) IC13.13(F:I)
PC7: IC9.11(PC7) IC13.11(E:I)
RESET: IC9.39(RESET) ; also sheet 2,5
VCC [POWER]: D8.+ IC9.29(VCC) IDE.41 IDE.42 ; also sheet 1,2,3,4,5,7
Unconnected: IDE.20 IDE.21 IDE.27 IDE.28 IDE.29 IDE.32 IDE.34

### Buses
DATA[0..7],!WR,!RD,!MREQ,!IORQ,!RESET
ADDR[0..19]

### Notes on the sheet
- INTEL 82C55
- IDE Interface Unused

## Sheet 7 of 7
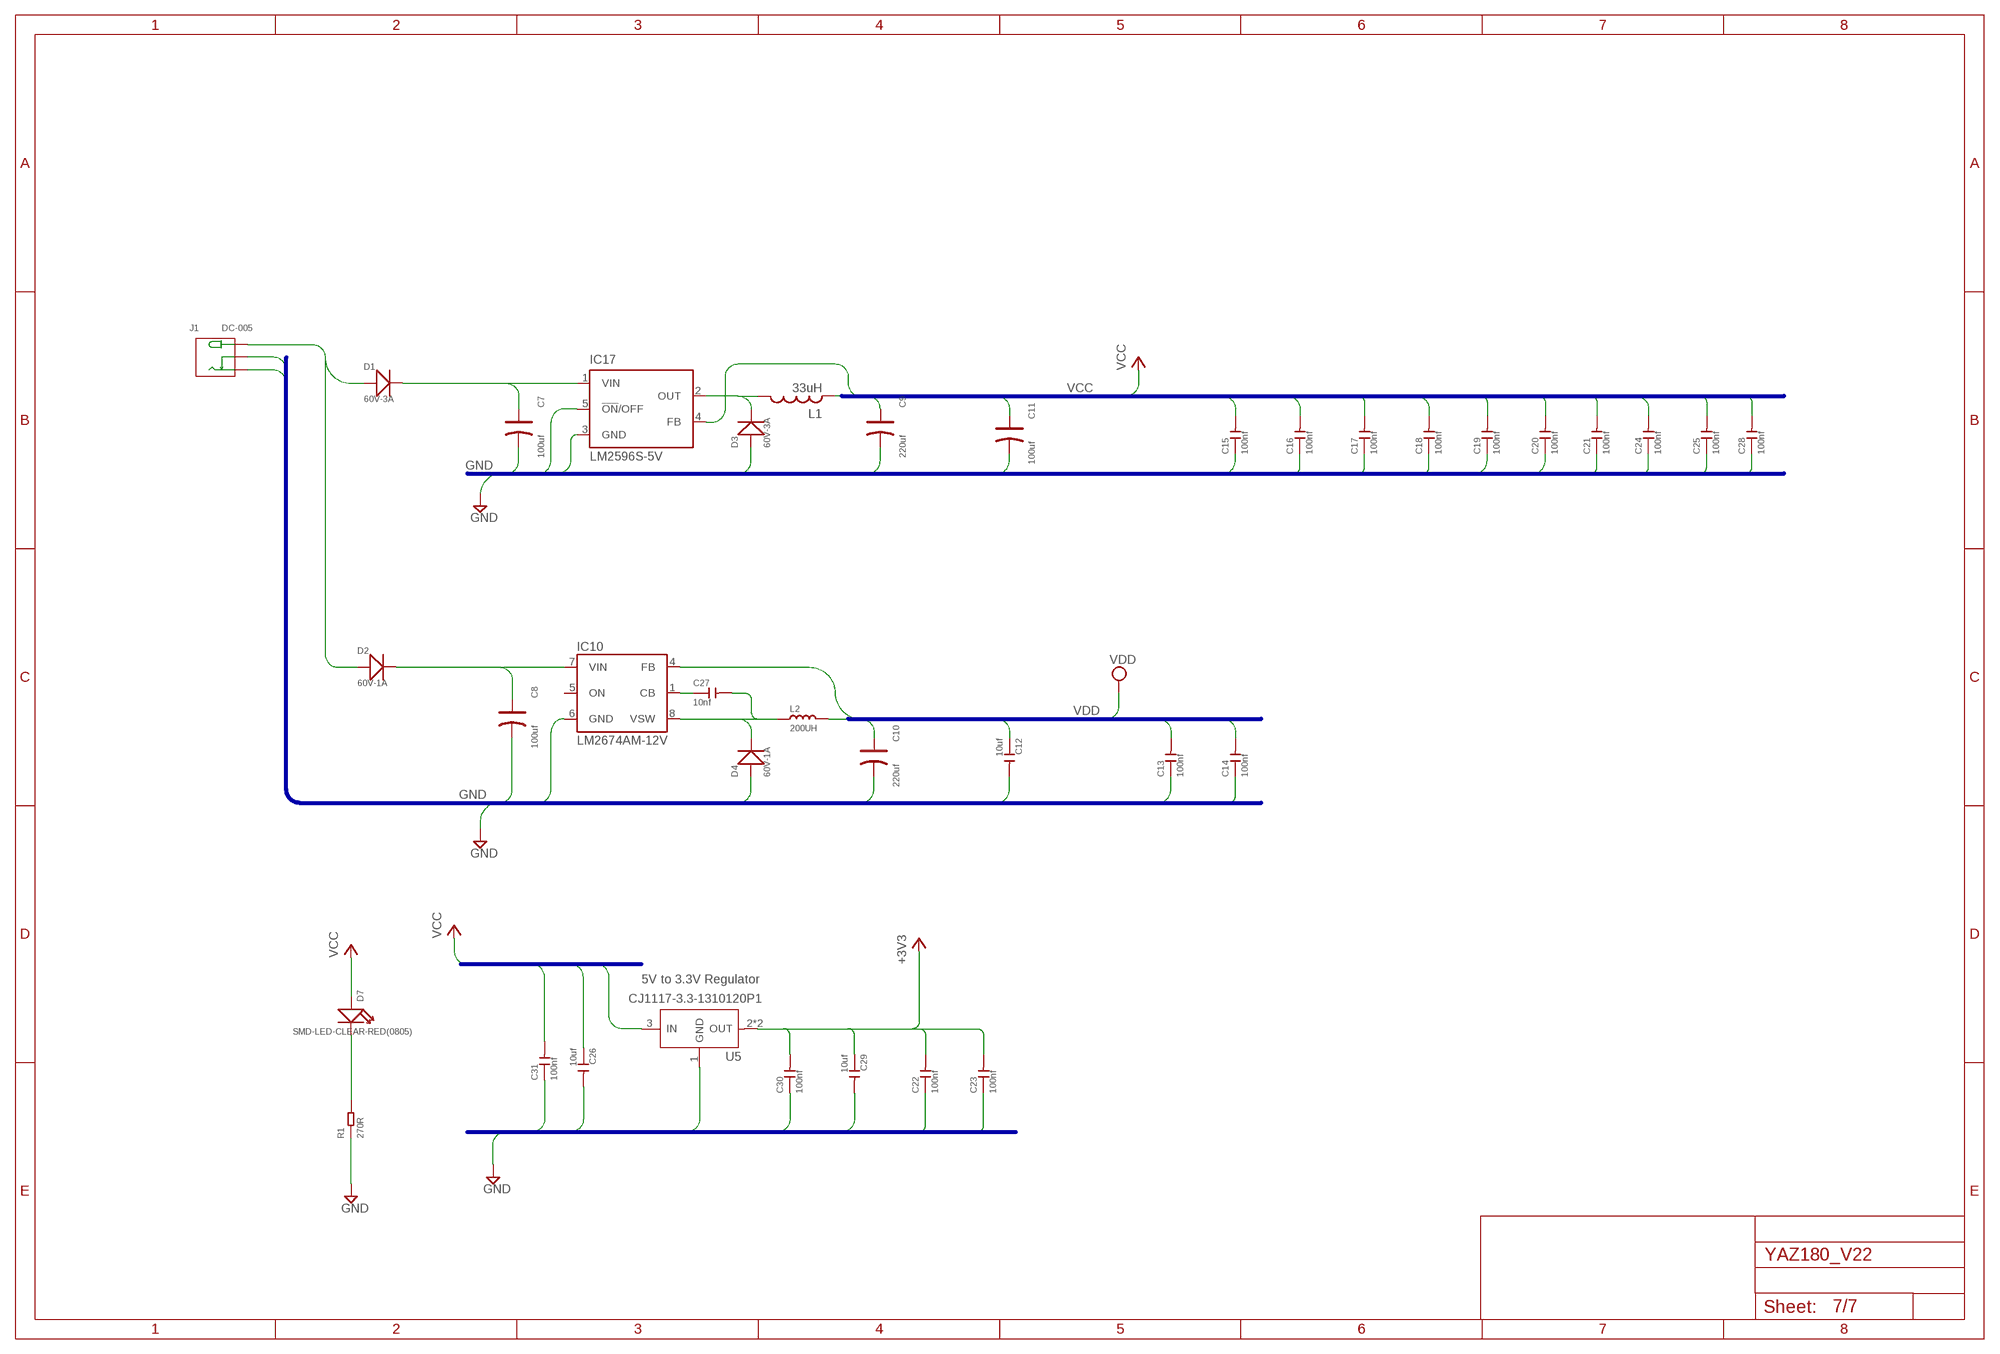
[diagram p6: schematic, sheet 7]

### Parts
C7  100uf  ALUMINUM-SMD-100UF-50V(D8-H10.5MM)  [ELECTRO-SMD-E-7.8MM]
C8  100uf  ALUMINUM-SMD-100UF-50V(D8-H10.5MM)  [ELECTRO-SMD-E-7.8MM]
C9  220uf  TANTALUM-SMD-220UF-16V(AVX-E)  [AVX-E]
C10  220uf  TANTALUM-SMD-220UF-16V(AVX-E)  [AVX-E]
C11  100uf  TANTALUM-SMD-100UF-16V(AVX-C)  [AVX-C]
C12  10uf  CERAMIC-10UF-25V-10%-X5R(0805)  [C0805]
C13  100nf  CERAMIC-100NF-50V-10%-X7R(0603)  [C0603]
C14  100nf  CERAMIC-100NF-50V-10%-X7R(0603)  [C0603]
C15  100nf  CERAMIC-100NF-50V-10%-X7R(0603)  [C0603]
C16  100nf  CERAMIC-100NF-50V-10%-X7R(0603)  [C0603]
C17  100nf  CERAMIC-100NF-50V-10%-X7R(0603)  [C0603]
C18  100nf  CERAMIC-100NF-50V-10%-X7R(0603)  [C0603]
C19  100nf  CERAMIC-100NF-50V-10%-X7R(0603)  [C0603]
C20  100nf  CERAMIC-100NF-50V-10%-X7R(0603)  [C0603]
C21  100nf  CERAMIC-100NF-50V-10%-X7R(0603)  [C0603]
C22  100nf  CERAMIC-100NF-50V-10%-X7R(0603)  [C0603]
C23  100nf  CERAMIC-100NF-50V-10%-X7R(0603)  [C0603]
C24  100nf  CERAMIC-100NF-50V-10%-X7R(0603)  [C0603]
C25  100nf  CERAMIC-100NF-50V-10%-X7R(0603)  [C0603]
C26  10uf  CERAMIC-10UF-25V-10%-X5R(0805)  [C0805]
C27  10nf  CERAMIC-10NF-50V-10%-X7R(0603)  [C0603]
C28  100nf  CERAMIC-100NF-50V-10%-X7R(0603)  [C0603]
C29  10uf  CERAMIC-10UF-25V-10%-X5R(0805)  [C0805]
C30  100nf  CERAMIC-100NF-50V-10%-X7R(0603)  [C0603]
C31  100nf  CERAMIC-100NF-50V-10%-X7R(0603)  [C0603]
D1  60V-3A  SMD-DIODE-SCHOTTKY-60V-1A(SOD-323)  [SOD-323]
D2  60V-1A  SMD-DIODE-SCHOTTKY-60V-1A(SOD-323)  [SOD-323]
D3  60V-3A  SMD-DIODE-SCHOTTKY-60V-1A(SOD-323)  [SOD-323]
D4  60V-1A  SMD-DIODE-SCHOTTKY-60V-1A(SOD-323)  [SOD-323]
D7  SMD-LED-CLEAR-RED(0805)  [LED-0805]
IC10  LM2674AM-12V  LM2674AM  [SO08]
IC17  LM2596S-5V  LM2596S  [TO263-5]
J1  DC-005  CONN-POWER-JACK-2.1MM(DC-005)  [DCJ3P-14.2X11.0X9.0MM]
L1  33uH  MSS1260  [MSS1260]
L2  200UH  SMD-INDUCTOR-200UH-20%(2P-5X5MM)  [SMD-2P-5.0X5.0X2.0MM]
R1  270R  SMD-RES-270R-1%-1/10W(0603)  [R0603]
U5  CJ1117-3.3-1310120P1  [SOT89]

### Nets
+3V3 [POWER]: C22.2 C23.2 C29.1 C30.2 U5.2(OUT) U5.4(OUT) ; also sheet 4,5
GND [POWER]: C7.- C8.- C9.- C10.- C11.- C12.2 C13.1 C14.1 C15.1 C16.1 C17.1 C18.1 C19.1 C20.1 C21.1 C22.1 C23.1 C24.1 C25.1 C26.2 C28.1 C29.2 C30.1 C31.1 D3.+ D4.+ IC10.6(GND) IC17.3(GND) IC17.5(!ON!/OFF) J1.-1(-) J1.-2(CDN) R1.1 U5.1(GND) ; also sheet 1,2,3,4,5,6
N$5: C27.1 IC10.1(CB)
N$78: D1.+ D2.+ J1.+
N$81: D7.- R1.2
N$82: C7.+ D1.- IC17.1(VIN)
N$83: C8.+ D2.- IC10.7(VIN)
N$84: D3.- IC17.2(OUT) L1.P$1
N$87: C27.2 D4.- IC10.8(VSW) L2.1
VCC [POWER]: C9.+ C11.+ C15.2 C16.2 C17.2 C18.2 C19.2 C20.2 C21.2 C24.2 C25.2 C26.1 C28.2 C31.2 D7.+ IC17.4(FB) L1.P$2 U5.3(IN) ; also sheet 1,2,3,4,5,6
VDD [POWER]: C10.+ C12.1 C13.2 C14.2 IC10.4(FB) L2.2 ; also sheet 5
Unconnected: IC10.5(ON)

### Buses
GND
VDD
VCC

### Notes on the sheet
- 5V to 3.3V Regulator

## Power pins joined to a net without a drawn wire
GND: IC1.10(GND) IC8.7(GND) IC13.7(P:GND)
VCC: IC1.5(VCC) IC8.14(VCC) IC13.14(P:VCC)

## Library data of the parts
!INT_IDE = testpad:TPS: TEST PIN
C1 C2 C13-C25 C28 C30-C32 = Seeed-OPL-Capacitor:CERAMIC-100NF-50V-10%-X7R(0603): 302010138; MPN: CC0603KRX7R9BB104
C3 C4 C6 = Seeed-OPL-Capacitor:CERAMIC-22PF-50V-5%-NPO(0603): 302010143
C5 = Seeed-OPL-Capacitor:CERAMIC-2.2UF-10V-10%-X7R(0603): 302010054; MPN: CC0603KRX7R6BB225
C7 C8 = Seeed-OPL-Capacitor:ALUMINUM-SMD-100UF-50V(D8-H10.5MM): 302030095; MPN: CS1H101M-CRF10
C9 C10 = Seeed-OPL-Capacitor:TANTALUM-SMD-220UF-16V(AVX-E): 302020032; MPN: TAJE227K016RNJ
C11 = Seeed-OPL-Capacitor:TANTALUM-SMD-100UF-16V(AVX-C): 302020023; MPN: TAJC107K016RNJ
C12 C26 C29 = Seeed-OPL-Capacitor:CERAMIC-10UF-25V-10%-X5R(0805): 302010178; MPN: CC0805KKX5R8BB106
C27 = Seeed-OPL-Capacitor:CERAMIC-10NF-50V-10%-X7R(0603): 302010140; MPN: CC0603KRX7R9BB103
D1 D3 = Seeed-OPL-Diode:SMD-DIODE-SCHOTTKY-60V-1A(SOD-323): 304020026; MPN: PMEG6010CEJ,115; VALUE: 60V-1A
D2 D4 = Seeed-OPL-Diode:SMD-DIODE-SCHOTTKY-60V-1A(SOD-323): 304020026; MPN: PMEG6010CEJ,115
D5 = Seeed-OPL-Diode:SMD-LED-CLEAR-YELLOW(0805): 304090039; MPN: 17-215UYC/S530-A3/TR8
D6 = Seeed-OPL-Diode:SMD-LED-CLEAR-GREEN(0805): 304090057; MPN: 17-215SYGC/S530-E2/TR8
D7 D8 = Seeed-OPL-Diode:SMD-LED-CLEAR-RED(0805): 304090046; MPN: 17-215SURC/S530-A2/TR8
DIS1-DIS9 = YAZ180_V1:HTIL311A: LED DISPLAY 1-character dot matrix, 2 decimal points Internal TTL MSI IC with Latch, Decoder, and Driver Source: http://www.taosinc.com .. til311-e6.pdf; OC_FARNELL: unknown; OC_NEWARK: unknown
ESP-01S = Seeed-OPL-Connector:DIP-BLACK-FEMALE-HEADER(2X4P-2.54): 320030087; VALUE: 2X4P-2.54
IC1 = 74xx-eu:74*93: Decade, divide by twelve and binary COUNTER
IC3 = 74xx-eu:74*74: Dual D type positive edge triggered FLIP FLOP, preset and clear
IC4 = memory-issi-asynsram:IS62WV10248DALL-*: 1024k x 8 low voltage, ultra low power CMOS static RAM 55ns access time 2.2V power supply
IC5 = YAZ180_V1:SST39VF010: 1 Mbit x8 Multi-Purpose Flash Source: http://www.sst.com/dotAsset/40782.pdf
IC6 IC7 = atmel:ATF16V8B: High perfomance CMOS (electrically erasable) programmable logic device (PLD) ABLE-Atmel-ABEL - P18V8R, P16V8C, P16V8AS, P17V8 COPL Atmel-WinCUPL - G16V8MS, G16V8MA, G16V8AS, G16V8 LOG/IC - GAL16V8_R, GAL16V8_G7, GAL16V8_C), GAL16V8 Tango-PLD - G16V8R, G16V8C, G16V8AS, G16V8 Source: http://www.atmel.com/dyn/resources/prod_documents/DOC0364.PDF; MPN: ATF16V8CZ-15PU; OC_FARNELL: 1551768; OC_NEWARK: 94M6254
IC8 = 74xx-us:74*121: Monostable MULTIVIBRATOR, schmitt trigger inputs
IC9 = YAZ180_V1:82C55A: MICROCOMPUTER/PERIPHERAL DEVICE
IC10 = v-reg-3:LM2674A: National Semiconductor <http://www.national.com> 0.5A "Simple Switcher"(c) 260kHz, Vout 1.2-37V, Vin 40V, 250mOhm DMOS switch, 50µA standby current
IC11 = YAZ180_V1:FT232RL: USB UART 4th Generation USB UART (USB <-> Serial) Controller
IC12 = YAZ180_V1:FT245RL: USB FIFO Controller 4th Generation USB Controller (USB <-> Parallel) - FIFO
IC13 = 74xx-eu:74*04: Hex INVERTER
IC14 IC15 = I2CBB-parts:PCA9665: IC CNTRLR PARALLEL/I2C 20TSSOP
IC17 = national-semiconductor:LM2596: SIMPLE SWITCHER® Power Converter 150 kHz 3A Step-Down Voltage Regulator Source: http://www.national.com/ds/LM/LM2596.pdf; MF: NATIONAL SEMICONDUCTOR; MPN: LM2596S-ADJ/NOPB; OC_FARNELL: 9494367; OC_NEWARK: 41K3842
IDE = con-molex:87758-4416: 44 Pin - 2mm Dual Row Single Wafer, Vertical T/H HDR Source: http://www.molex.com/pdm_docs/sd/877580616_sd.pdf; MF: MOLEX; MPN: 87758-4416; OC_FARNELL: unknown; OC_NEWARK: 59J1588
J1 = Seeed-OPL-Connector:CONN-POWER-JACK-2.1MM(DC-005): 320120003; MPN: DC-005
J2 J3 = Seeed-OPL-Connector:GROVE-CONNECTOR-DIP-90D(4P-2.0): 320110034
J6 J7 = SparkFun-Connectors:I2C_STANDARD: SparkFun has standardized on a pinout for all I2C based sensor breakouts. This pinout allows I2C boards to be plugged directly into the headers on Arduino Uno compatible boards, and to be daisy chained easily.
L1 = inductor-coilcraft:MSS1260: SMT Power Inductor
L2 = Seeed-OPL-Inductor:SMD-INDUCTOR-200UH-20%(2P-5X5MM): 303010140; MPN: SWPA5020S220MT
R1 R3 R4 R8 R24 = Seeed-OPL-Resistor:SMD-RES-270R-1%-1/10W(0603): 301010197; MPN: RC0603FR-07270RL
R2 R5-R7 R12 R16-R19 = Seeed-OPL-Resistor-V2:SMD-RES-10K-1%-1/10W(0603): 301010299; MPN: RC0603FR-0710KL
R9 R14 R15 = Seeed-OPL-Resistor:SMD-RES-4.7K-5%-1/10W(0603): 301010290; MPN: RC0603JR-074K7L
R10 R11 R13 = Seeed-OPL-Resistor:SMD-RES-10K-1%-1/10W(0603): 301010299; MPN: RC0603FR-0710KL
R20-R23 = Seeed-OPL-Resistor:SMD-RES-2.2K-5%-1/10W(0603): 301010124; MPN: RC0603JR-072K2L
SW1 SW2 = Seeed-OPL-Switch:SMD-BUTTON(4P-4.0X4.0X1.7MM): 311020027
SW3 = Seeed-OPL-Switch:DIP-SLIDE-SWITCH(3P-11.6X4.0X5.4+2.0MM): 311010006
U1 = z180:Z8X180: Zilog Z80S180/Z80L180 Packages PLCC and PLCC Socket (Normal and SMD) Armin Diehl 02/2007 diehl@nordrhein.de
U2 = FX-Z180 Rev A:AM9511
U3 = Texas Instruments_By_element14_Batch_1:SN74ABTH245DW: OCTAL BUS TRANSCEIVERS; MPN: SN74ABTH245DW; OC_FARNELL: 1739615; OC_NEWARK: 50R5691; PACKAGE: SOIC-20; SUPPLIER: Texas Instruments
U4 = Texas Instruments_By_element14_Batch_1:SN74ABT541BDW: OCTAL BUFFERS/DRIVERS; MPN: SN74ABT541BDW; OC_FARNELL: 9590170; OC_NEWARK: 85F222; PACKAGE: SOIC-20; SUPPLIER: Texas Instruments
U5 = OPL Eagle Library:CJ1117-3.3: 1A Low Dropout Linear Regulator
U7 = Texas Instruments_By_element14_Batch_1:SN74LVC1G97DCKR: CONFIGURABLE MULTIPLE-FUNCTION GATE; MPN: SN74LVC1G97DCKR; OC_FARNELL: 1470839; OC_NEWARK: 32H6376; PACKAGE: SOT-23-6; SUPPLIER: Texas Instruments
U21 = Maxim_By_element14_Batch_1:MAX6817EUT+T: ±15kV ESD-Protected CMOS Switch Debouncers; MPN: MAX6817EUT+T; OC_FARNELL: 1299771; OC_NEWARK: 68K9458; PACKAGE: SOT23-6; SUPPLIER: Maxim
U22 = Texas Instruments_By_element14_Batch_1:TLC7705ID: MICROPOWER SUPPLY VOLTAGE SUPERVISOR; MPN: TLC7705ID; OC_FARNELL: 8454663; OC_NEWARK: 35K1226; PACKAGE: SOIC-8; SUPPLIER: Texas Instruments
X1 X2 = SparkFun-Connectors:USB: USB Connectors USB-B-PTH is fully proven SKU : PRT-00139/CONN-08278 USB-miniB is fully proven SKU : PRT-00587 USB-A-PCB is untested. USB-A-H is throughly reviewed, but untested. Spark Fun Electronics SKU : PRT-00437 USB-B-SMT is throughly reviewed, but untested. Needs silkscreen touching up. USB-A-S has not been used/tested USB-MB-H has not been used/tested USB-MICROB has been used. CONN-09505
X3-X6 = nxp_60_1_1:FIDUCIAL_0.6-1.2MM
Y1 = Seeed-OPL-crystal-osctllator:DIP-CRYSTAL-25MHZ-20PF-20PPM(HC49US): 306010005; MPN: 49S; VALUE: 25MHZ